# EAGLE design sr_controller_v1 (EAGLE 6.3)
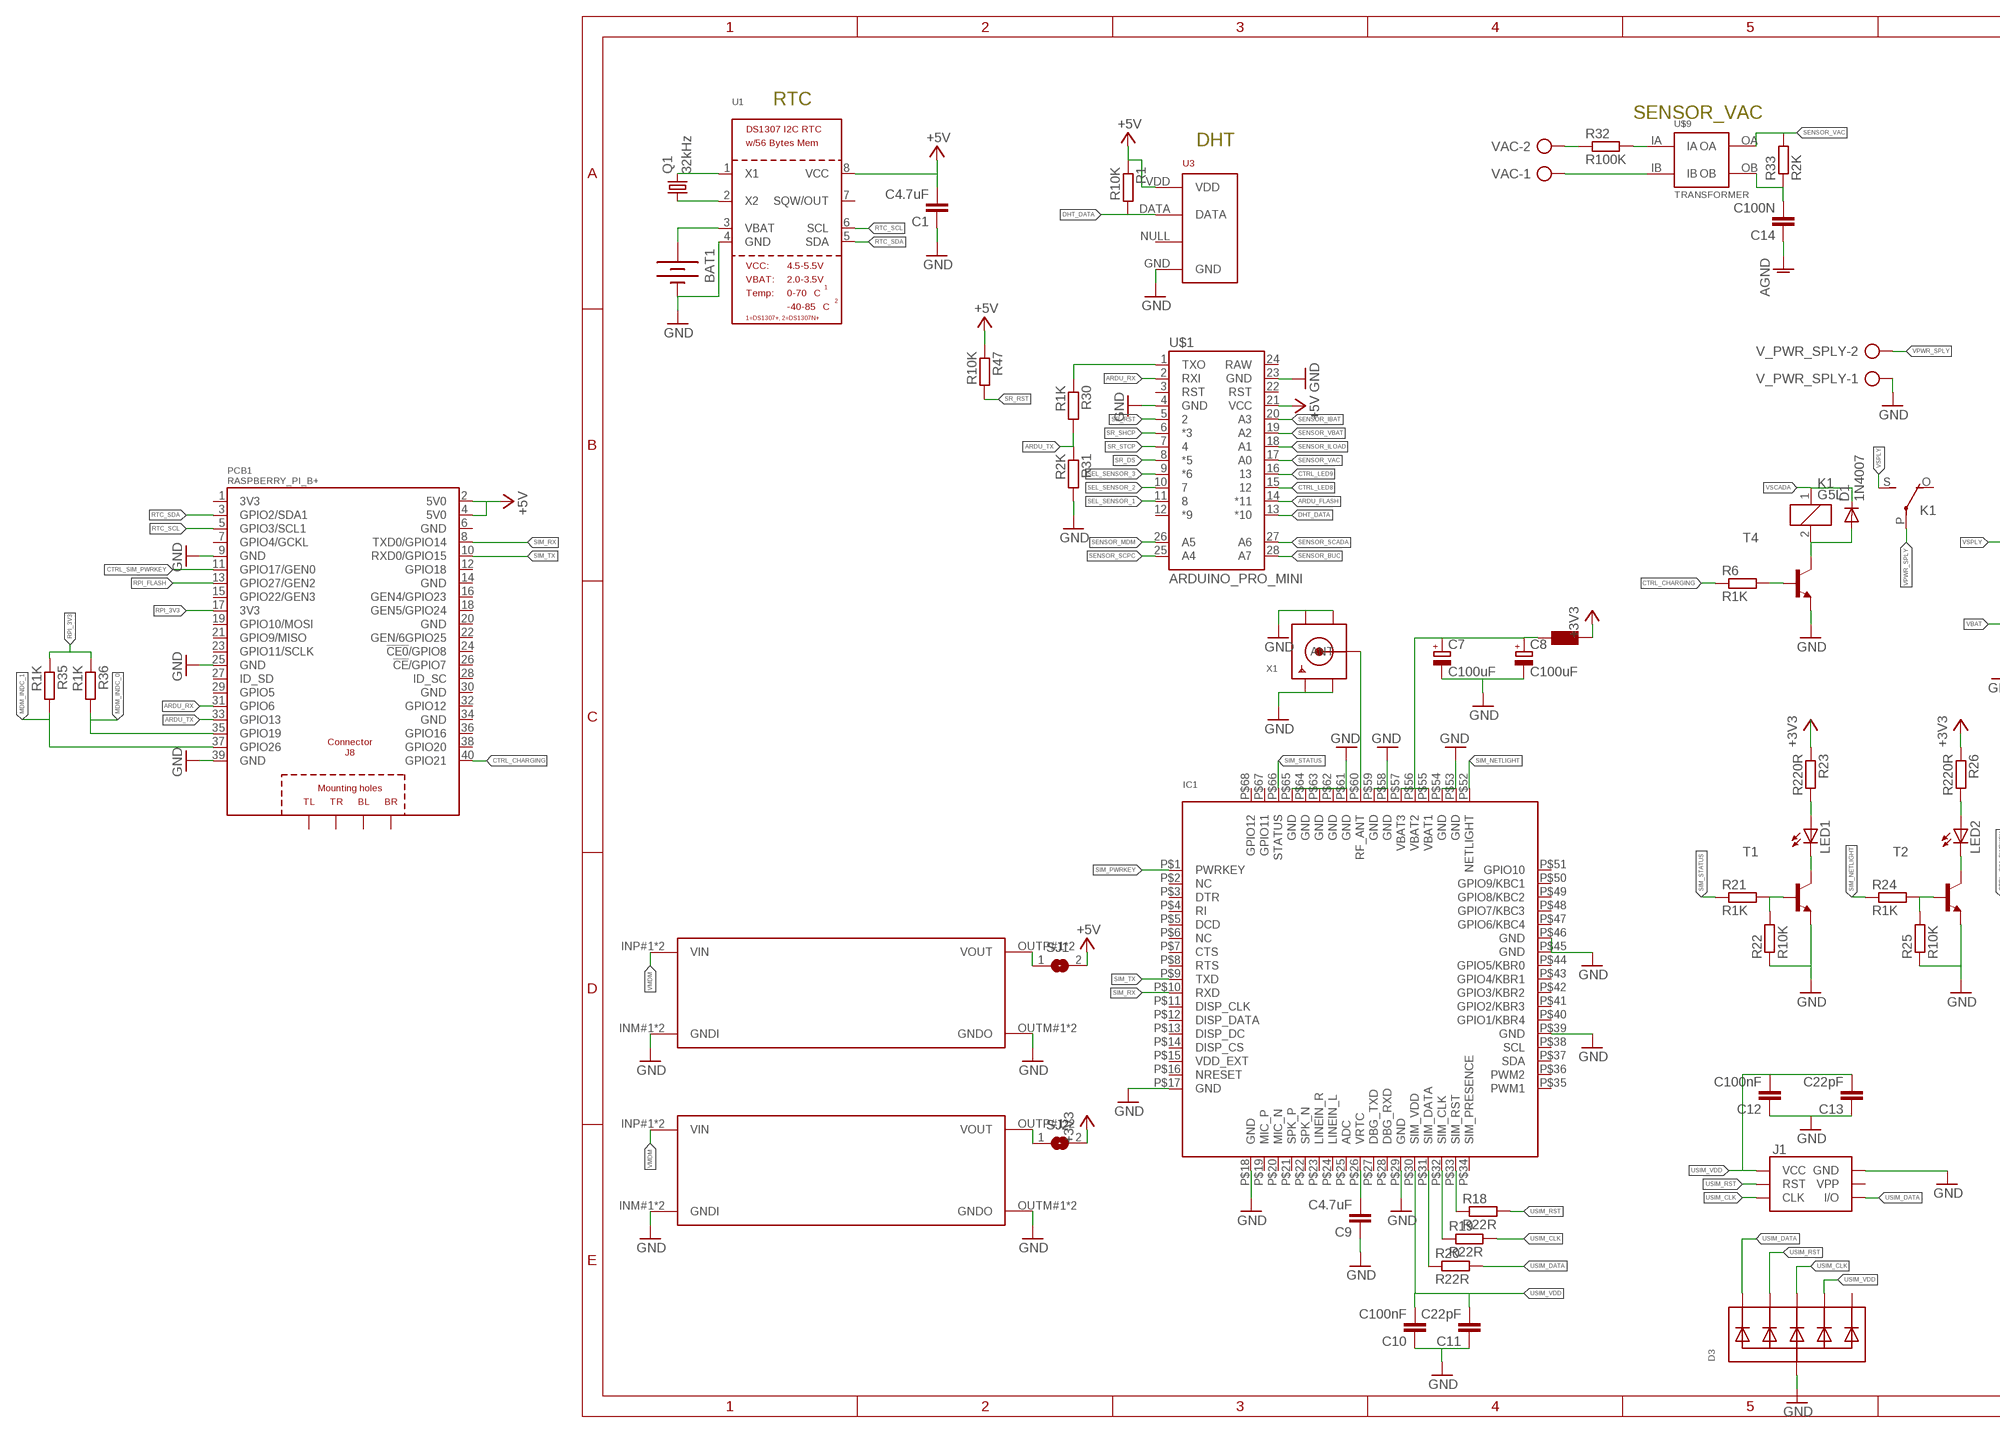
[diagram p0: schematic, sheet 1, part 1 of 2]
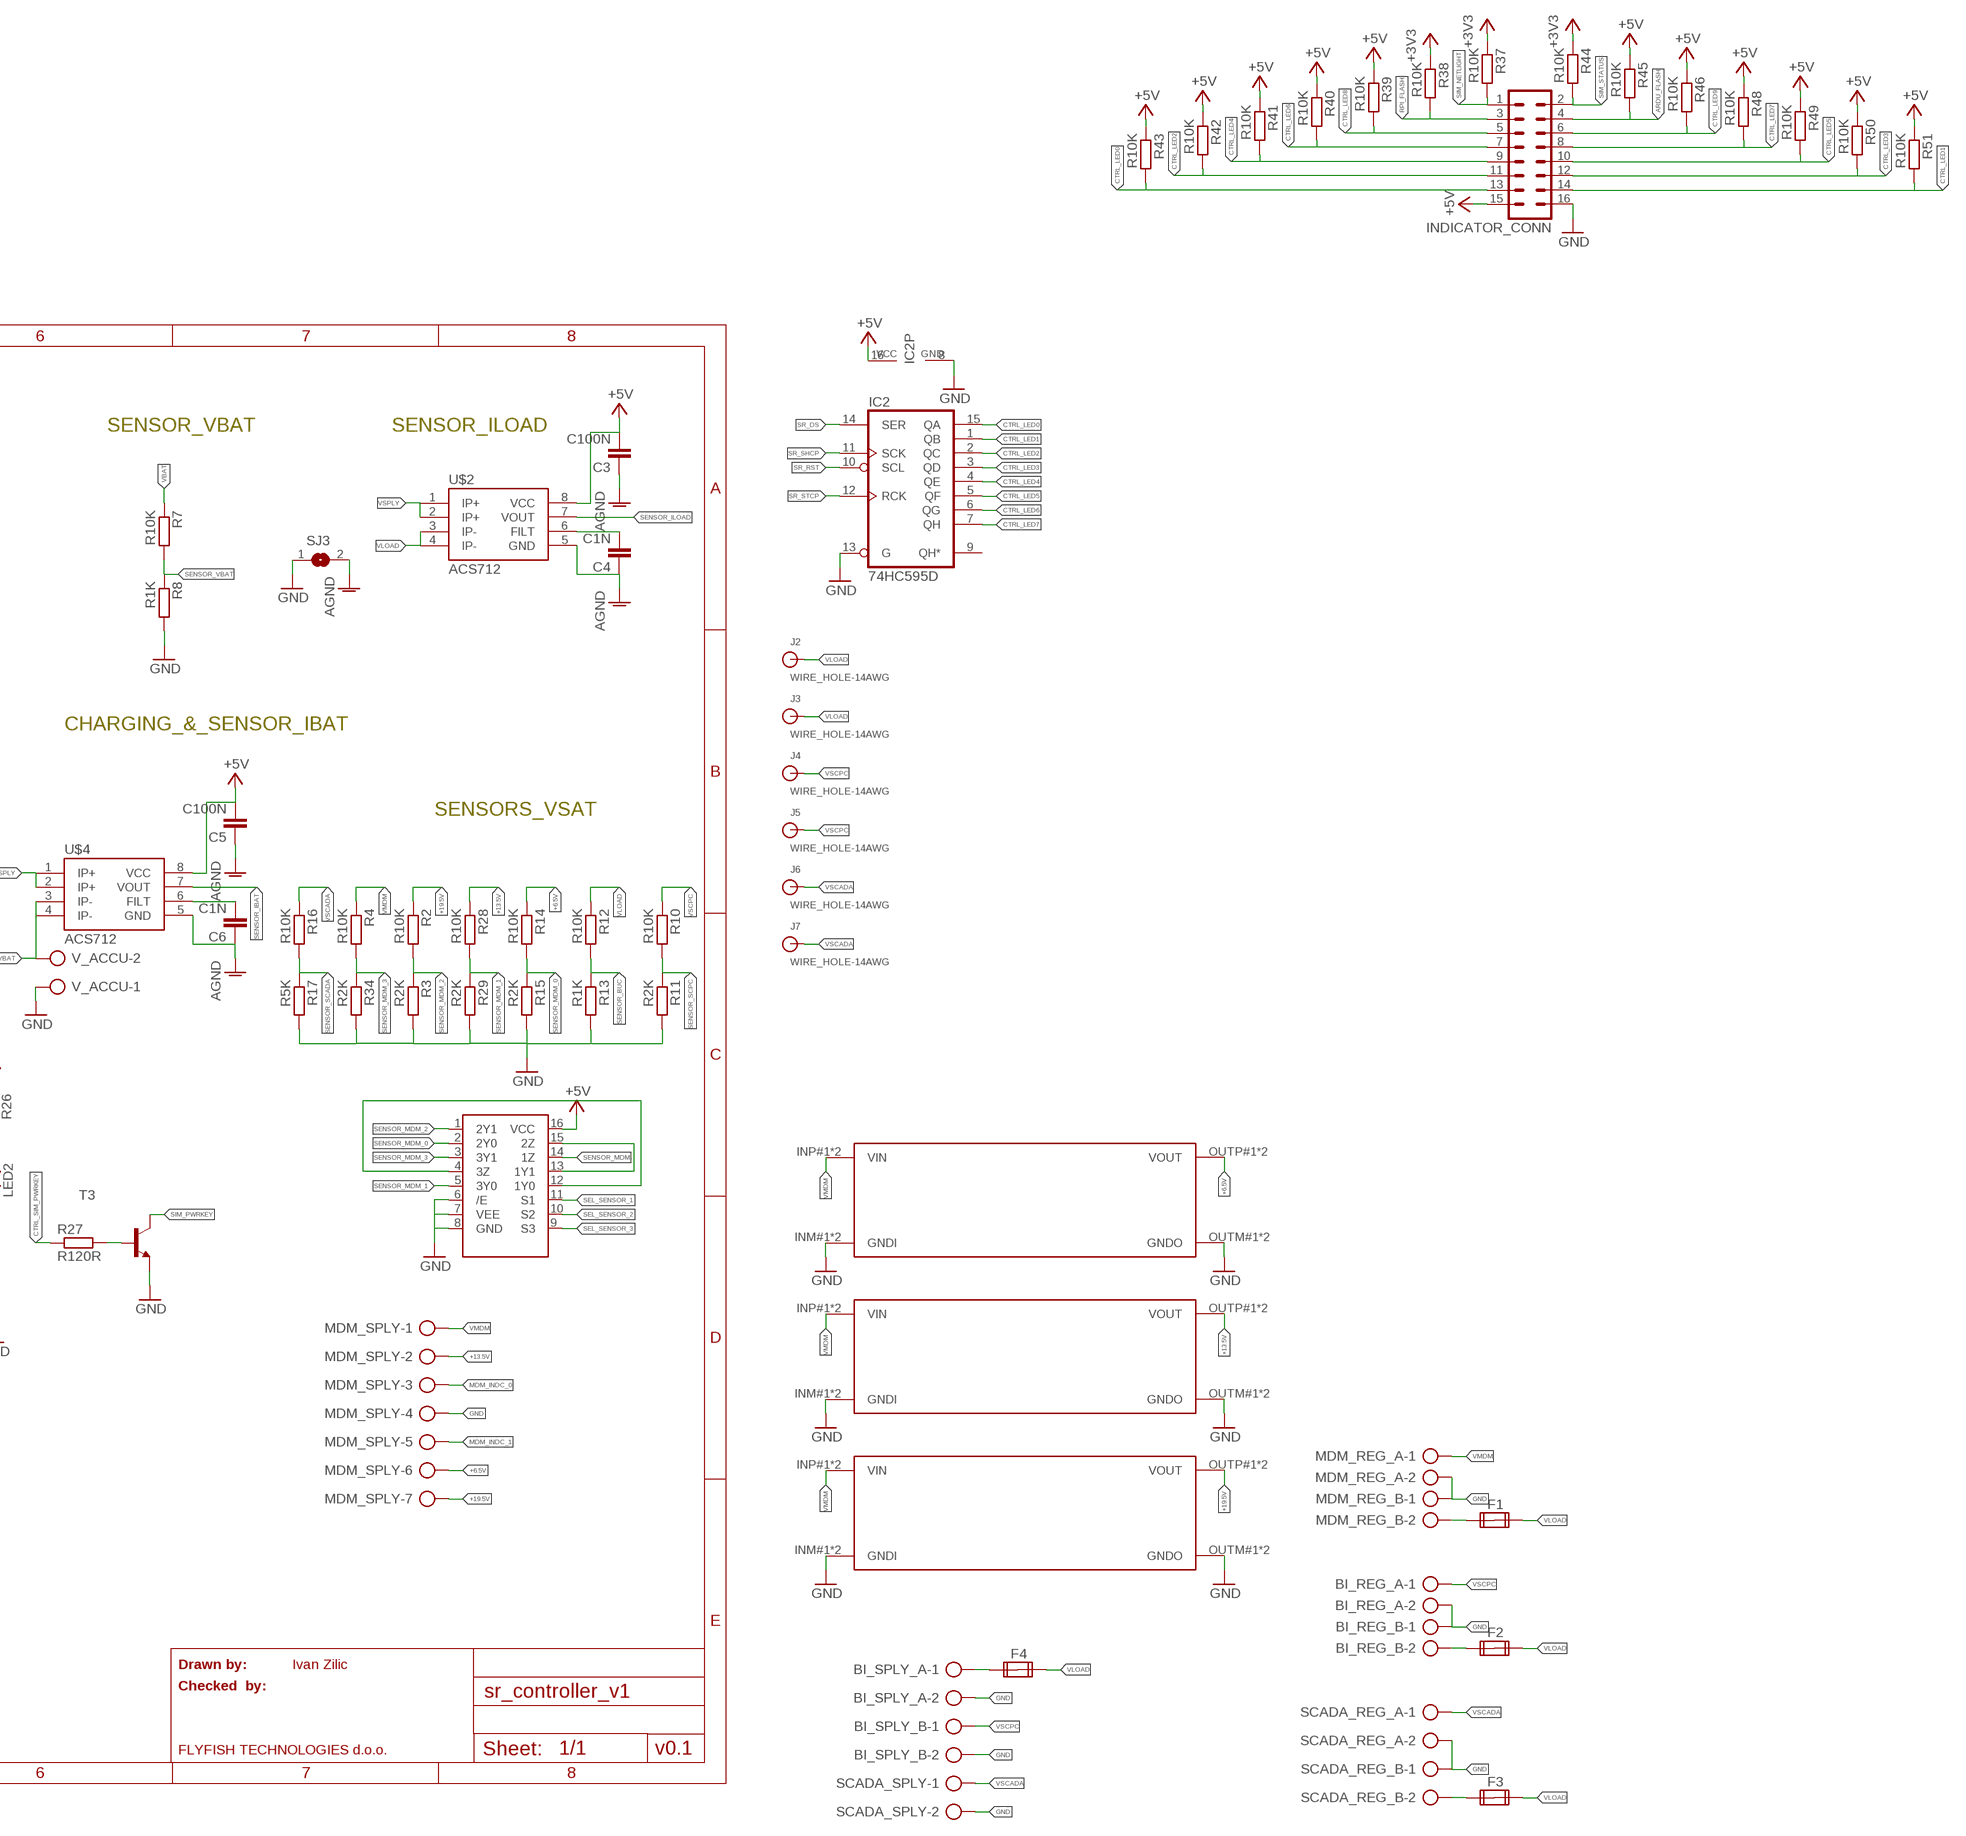
[diagram p1: schematic, sheet 1, part 2 of 2]

## Parts
BAT1  BATTERY20PTH  [BATTCOM_20MM_PTH]
BI_REG_A  AK300/2  [AK300/2]
BI_REG_B  AK300/2  [AK300/2]
BI_SPLY_A  AK300/2  [AK300/2]
BI_SPLY_B  AK300/2  [AK300/2]
C1  C4.7uF  C-EUC0805  [C0805]
C3  C100N  C-EUC0805K  [C0805K]
C4  C1N  C-EUC0805K  [C0805K]
C5  C100N  C-EUC0805K  [C0805K]
C6  C1N  C-EUC0805K  [C0805K]
C7  C100uF  CPOL-EU153CLV-0605  [153CLV-0605]
C8  C100uF  CPOL-EU153CLV-0605  [153CLV-0605]
C9  C4.7uF  C-EUC0805  [C0805]
C10  C100nF  C-EUC0805  [C0805]
C11  C22pF  C-EUC0805  [C0805]
C12  C100nF  C-EUC0805  [C0805]
C13  C22pF  C-EUC0805  [C0805]
C14  C100N  C-EUC0805K  [C0805K]
D1  1N4007  DIODE-DO214AA  [DO214AA]
D3  TVSARRAY_5LANE  [SOT363]
F1  FUSE2P  [FUSE1]
F2  FUSE2P  [FUSE1]
F3  FUSE2P  [FUSE1]
F4  FUSE2P  [FUSE1]
IC1  GSM_SIM900_LITERAL  [SIM900_SMT]
IC2  74HC595D  [SO16]
INDICATOR_CONN  MA08-2  [MA08-2]
J1  SIMHOLDERSIM  [SIMHOLDER]
J2  WIRE_HOLE-14AWG  [WIRE_HOLE-14AWG]
J3  WIRE_HOLE-14AWG  [WIRE_HOLE-14AWG]
J4  WIRE_HOLE-14AWG  [WIRE_HOLE-14AWG]
J5  WIRE_HOLE-14AWG  [WIRE_HOLE-14AWG]
J6  WIRE_HOLE-14AWG  [WIRE_HOLE-14AWG]
J7  WIRE_HOLE-14AWG  [WIRE_HOLE-14AWG]
K1  G5L  [G5LE]
LED1  LEDCHIPLED_0805  [CHIPLED_0805]
LED2  LEDCHIPLED_0805  [CHIPLED_0805]
MDM_REG_A  AK300/2  [AK300/2]
MDM_REG_B  AK300/2  [AK300/2]
MDM_SPLY  AK300/7  [AK300/7]
PCB1  RASPBERRY_PI_B+  [RASPBERRY_PI_B+]
Q1  32kHz  CRYSTALTC38H  [TC38H]
R1  R10K  R-EU_R0805  [R0805]
R2  R10K  R-EU_R0805  [R0805]
R3  R2K  R-EU_R0805  [R0805]
R4  R10K  R-EU_R0805  [R0805]
R6  R1K  R-EU_R0805  [R0805]
R7  R10K  R-EU_R0805  [R0805]
R8  R1K  R-EU_R0805  [R0805]
R10  R10K  R-EU_R0805  [R0805]
R11  R2K  R-EU_R0805  [R0805]
R12  R10K  R-EU_R0805  [R0805]
R13  R1K  R-EU_R0805  [R0805]
R14  R10K  R-EU_R0805  [R0805]
R15  R2K  R-EU_R0805  [R0805]
R16  R10K  R-EU_R0805  [R0805]
R17  R5K  R-EU_R0805  [R0805]
R18  R22R  R-EU_R0805  [R0805]
R19  R22R  R-EU_R0805  [R0805]
R20  R22R  R-EU_R0805  [R0805]
R21  R1K  R-EU_R0805  [R0805]
R22  R10K  R-EU_R0805  [R0805]
R23  R220R  R-EU_R0805  [R0805]
R24  R1K  R-EU_R0805  [R0805]
R25  R10K  R-EU_R0805  [R0805]
R26  R220R  R-EU_R0805  [R0805]
R27  R120R  R-EU_R0805  [R0805]
R28  R10K  R-EU_R0805  [R0805]
R29  R2K  R-EU_R0805  [R0805]
R30  R1K  R-EU_R0805  [R0805]
R31  R2K  R-EU_R0805  [R0805]
R32  R100K  R-EU_0309/10  [0309/10]
R33  R2K  R-EU_0309/10  [0309/10]
R34  R2K  R-EU_R0805  [R0805]
R35  R1K  R-EU_R0805  [R0805]
R36  R1K  R-EU_R0805  [R0805]
R37  R10K  R-EU_R0805  [R0805]
R38  R10K  R-EU_R0805  [R0805]
R39  R10K  R-EU_R0805  [R0805]
R40  R10K  R-EU_R0805  [R0805]
R41  R10K  R-EU_R0805  [R0805]
R42  R10K  R-EU_R0805  [R0805]
R43  R10K  R-EU_R0805  [R0805]
R44  R10K  R-EU_R0805  [R0805]
R45  R10K  R-EU_R0805  [R0805]
R46  R10K  R-EU_R0805  [R0805]
R47  R10K  R-EU_R0805  [R0805]
R48  R10K  R-EU_R0805  [R0805]
R49  R10K  R-EU_R0805  [R0805]
R50  R10K  R-EU_R0805  [R0805]
R51  R10K  R-EU_R0805  [R0805]
SCADA_REG_A  AK300/2  [AK300/2]
SCADA_REG_B  AK300/2  [AK300/2]
SCADA_SPLY  AK300/2  [AK300/2]
SJ1  SOLDERJUMPER  [SOLDERJUMPER_ARROW_NOPASTE]
SJ2  SOLDERJUMPER  [SOLDERJUMPER_ARROW_NOPASTE]
SJ3  SOLDERJUMPERCLOSED  [SOLDERJUMPER_CLOSEDWIRE]
T1  MMBT2222ALT1-NPN-SOT23-BEC  [SOT23-BEC]
T2  MMBT2222ALT1-NPN-SOT23-BEC  [SOT23-BEC]
T3  MMBT2222ALT1-NPN-SOT23-BEC  [SOT23-BEC]
T4  MMBT2222ALT1-NPN-SOT23-BEC  [SOT23-BEC]
U1  RTC_DS1307  [SOIC8_150MIL]
U3  RHT03_DHT-22_AM2302  [RHT03_DHT-22]
U$1  ARDUINO_PRO_MINI  [ARDUINO_PRO_MINI]
U$2  ACS712  [SO08]
U$4  ACS712  [SO08]
U$5  FB0603  L0603  [L0603]
U$6  DCDCMODULE_SMALL  [DCDCMODULE-SMALL]
U$7  DCDCMODULE_SMALL  [DCDCMODULE-SMALL]
U$8  74HC4053D  [SO16]
U$9  TRANSFORMER  [TV16]
U$10  DCDCMODULE_SMALL  [DCDCMODULE-SMALL]
U$11  DCDCMODULE_SMALL  [DCDCMODULE-SMALL]
U$13  DCDCMODULE_SMALL  [DCDCMODULE-SMALL]
V_ACCU  AK300/2  [AK300/2]
V_PWR_SPLY  AK300/2  [AK300/2]
VAC  AK300/2  [AK300/2]
X1  SMACONNECTOR  [SMA90_DIP]

## Nets
+3V3: R23.1 R26.1 R37.1 R38.1 R44.1 SJ2.2 U$5.2
+5V: C1.2 C3.2 C5.2 IC2.16(VCC) INDICATOR_CONN.15 PCB1.2(5V0) PCB1.4(5V0) R1.1 R39.1 R40.1 R41.1 R42.1 R43.1 R45.1 R46.1 R47.1 R48.1 R49.1 R50.1 R51.1 SJ1.2 U1.8(VCC) U3.VDD U$1.21(VCC) U$2.8(VCC) U$4.8(VCC) U$8.16(VCC)
+6.5V: MDM_SPLY.6 R14.1 U$13.OUTP#1(VOUT) U$13.OUTP#2(VOUT)
+13.5V: MDM_SPLY.2 R28.1 U$10.OUTP#1(VOUT) U$10.OUTP#2(VOUT)
+19.5V: MDM_SPLY.7 R2.1 U$11.OUTP#1(VOUT) U$11.OUTP#2(VOUT)
AGND: C3.1 C4.1 C5.1 C6.1 C14.1 SJ3.2 U$2.5(GND) U$4.5(GND)
ARDU_FLASH: INDICATOR_CONN.4 R45.2 U$1.14(*11)
ARDU_RX: PCB1.31(GPIO6) U$1.2(RXI)
ARDU_TX: PCB1.33(GPIO13) R30.2 R31.1
CTRL_CHARGING: PCB1.40(GPIO21) R6.1
CTRL_LED0: IC2.15(QA) INDICATOR_CONN.13 R43.2
CTRL_LED1: IC2.1(QB) INDICATOR_CONN.14 R51.2
CTRL_LED2: IC2.2(QC) INDICATOR_CONN.11 R42.2
CTRL_LED3: IC2.3(QD) INDICATOR_CONN.12 R50.2
CTRL_LED4: IC2.4(QE) INDICATOR_CONN.9 R41.2
CTRL_LED5: IC2.5(QF) INDICATOR_CONN.10 R49.2
CTRL_LED6: IC2.6(QG) INDICATOR_CONN.7 R40.2
CTRL_LED7: IC2.7(QH) INDICATOR_CONN.8 R48.2
CTRL_LED8: INDICATOR_CONN.5 R39.2 U$1.15
CTRL_LED9: INDICATOR_CONN.6 R46.2 U$1.16
CTRL_SIM_PWRKEY: PCB1.11(GPIO17/GEN0) R27.1
DHT_DATA: R1.2 U3.DATA U$1.13(*10)
GND: BAT1.2(-) BI_REG_A.2 BI_REG_B.1 BI_SPLY_A.2 BI_SPLY_B.2 C1.1 C7.- C8.- C9.1 C10.1 C11.1 C12.1 C13.1 D3.2(A) IC1.P$17(GND) IC1.P$18(GND) IC1.P$29(GND) IC1.P$39(GND) IC1.P$45(GND) IC1.P$46(GND) IC1.P$53(GND) IC1.P$54(GND) IC1.P$58(GND) IC1.P$59(GND) IC1.P$61(GND) IC1.P$62(GND) IC1.P$63(GND) IC1.P$64(GND) IC1.P$65(GND) IC2.8(GND) IC2.13(G) INDICATOR_CONN.16 J1.C5(GND) MDM_REG_A.2 MDM_REG_B.1 MDM_SPLY.4 PCB1.9(GND) PCB1.25(GND) PCB1.39(GND) R3.2 R8.2 R11.2 R13.2 R15.2 R17.2 R22.1 R25.1 R29.2 R31.2 R34.2 SCADA_REG_A.2 SCADA_REG_B.1 SCADA_SPLY.2 SJ3.1 T1.E T2.E T3.E T4.E U1.4(GND) U3.GND U$1.4(GND) U$1.23(GND) U$6.INM#1(GNDI) U$6.INM#2(GNDI) U$6.OUTM#1(GNDO) U$6.OUTM#2(GNDO) U$7.INM#1(GNDI) U$7.INM#2(GNDI) U$7.OUTM#1(GNDO) U$7.OUTM#2(GNDO) U$8.6(/E) U$8.7(VEE) U$8.8(GND) U$10.INM#1(GNDI) U$10.INM#2(GNDI) U$10.OUTM#1(GNDO) U$10.OUTM#2(GNDO) U$11.INM#1(GNDI) U$11.INM#2(GNDI) U$11.OUTM#1(GNDO) U$11.OUTM#2(GNDO) U$13.INM#1(GNDI) U$13.INM#2(GNDI) U$13.OUTM#1(GNDO) U$13.OUTM#2(GNDO) V_ACCU.1 V_PWR_SPLY.1 X1.GND1 X1.GND2 X1.GND3 X1.GND4
MDM_INDC_0: MDM_SPLY.3 PCB1.35(GPIO19) R36.2
MDM_INDC_1: MDM_SPLY.5 PCB1.37(GPIO26) R35.2
N$1: R32.1 VAC.2
N$2: U$9.IB VAC.1
N$3: Q1.2 U1.1(X1)
N$4: Q1.1 U1.2(X2)
N$5: BAT1.1(+) U1.3(VBAT)
N$6: U$8.13(1Y1) U$8.15(2Z)
N$7: U$8.4(3Z) U$8.12(1Y0)
N$8: SJ1.1 U$6.OUTP#1(VOUT) U$6.OUTP#2(VOUT)
N$9: SJ2.1 U$7.OUTP#1(VOUT) U$7.OUTP#2(VOUT)
N$10: C4.2 U$2.6(FILT)
N$13: R6.2 T4.B
N$16: C6.2 U$4.6(FILT)
N$17: F1.1A MDM_REG_B.2
N$18: BI_REG_B.2 F2.1A
N$19: F3.1A SCADA_REG_B.2
N$20: BI_SPLY_A.1 F4.1A
N$21: IC1.P$60(RF_ANT) X1.ANTENNA(ANT)
N$22: C7.+ C8.+ IC1.P$55(VBAT1) IC1.P$56(VBAT2) IC1.P$57(VBAT3) U$5.1
N$23: C9.2 IC1.P$26(VRTC)
N$24: IC1.P$33(SIM_RST) R18.1
N$25: IC1.P$32(SIM_CLK) R19.1
N$26: IC1.P$31(SIM_DATA) R20.1
N$27: LED1.C T1.C
N$28: LED1.A R23.2
N$29: LED2.C T2.C
N$30: R21.2 R22.2 T1.B
N$31: LED2.A R26.2
N$32: R24.2 R25.2 T2.B
N$33: R27.2 T3.B
N$34: D1.A K1.2 T4.C
N$35: R30.1 U$1.1(TXO)
N$36: R32.2 U$9.IA
N$38: C14.2 R33.1 U$9.OB
RPI_3V3: PCB1.17(3V3) R35.1 R36.1
RPI_FLASH: INDICATOR_CONN.3 PCB1.13(GPIO27/GEN2) R38.2
RTC_SCL: PCB1.5(GPIO3/SCL1) U1.6(SCL)
RTC_SDA: PCB1.3(GPIO2/SDA1) U1.5(SDA)
SEL_SENSOR_1: U$1.11 U$8.11(S1)
SEL_SENSOR_2: U$1.10 U$8.10(S2)
SEL_SENSOR_3: U$1.9(*6) U$8.9(S3)
SENSOR_BUC: R12.2 R13.1 U$1.28(A7)
SENSOR_IBAT: U$1.20(A3) U$4.7(VOUT)
SENSOR_ILOAD: U$1.18(A1) U$2.7(VOUT)
SENSOR_MDM: U$1.26(A5) U$8.14(1Z)
SENSOR_MDM_0: R14.2 R15.1 U$8.2(2Y0)
SENSOR_MDM_1: R28.2 R29.1 U$8.5(3Y0)
SENSOR_MDM_2: R2.2 R3.1 U$8.1(2Y1)
SENSOR_MDM_3: R4.2 R34.1 U$8.3(3Y1)
SENSOR_SCADA: R16.2 R17.1 U$1.27(A6)
SENSOR_SCPC: R10.2 R11.1 U$1.25(A4)
SENSOR_VAC: R33.2 U$1.17(A0) U$9.OA
SENSOR_VBAT: R7.2 R8.1 U$1.19(A2)
SIM_NETLIGHT: IC1.P$52(NETLIGHT) INDICATOR_CONN.1 R24.1 R37.2
SIM_PWRKEY: IC1.P$1(PWRKEY) T3.C
SIM_RX: IC1.P$10(RXD) PCB1.8(TXD0/GPIO14)
SIM_STATUS: IC1.P$66(STATUS) INDICATOR_CONN.2 R21.1 R44.2
SIM_TX: IC1.P$9(TXD) PCB1.10(RXD0/GPIO15)
SR_DS: IC2.14(SER) U$1.8(*5)
SR_RST: IC2.10(SCL) R47.2 U$1.5
SR_SHCP: IC2.11(SCK) U$1.6(*3)
SR_STCP: IC2.12(RCK) U$1.7
USIM_CLK: D3.4(C3) J1.C3(CLK) R19.2
USIM_DATA: D3.1(C1) J1.C7(I/O) R20.2
USIM_RST: D3.3(C2) J1.C2(RST) R18.2
USIM_VDD: C10.2 C11.2 C12.2 C13.2 D3.5(C4) IC1.P$30(SIM_VDD) J1.C1(VCC)
VBAT: R7.1 U$4.3(IP-) U$4.4(IP-) V_ACCU.2
VLOAD: F1.2A F2.2A F3.2A F4.2A J2.P$1 J3.P$1 R12.1 U$2.3(IP-) U$2.4(IP-)
VMDM: MDM_REG_A.1 MDM_SPLY.1 R4.1 U$6.INP#1(VIN) U$6.INP#2(VIN) U$7.INP#1(VIN) U$7.INP#2(VIN) U$10.INP#1(VIN) U$10.INP#2(VIN) U$11.INP#1(VIN) U$11.INP#2(VIN) U$13.INP#1(VIN) U$13.INP#2(VIN)
VPWR_SPLY: K1.P(2:P) V_PWR_SPLY.2
VSCADA: D1.C J6.P$1 J7.P$1 K1.1 R16.1 SCADA_REG_A.1 SCADA_SPLY.1
VSCPC: BI_REG_A.1 BI_SPLY_B.1 J4.P$1 J5.P$1 R10.1
VSPLY: K1.S(2:S) U$2.1(IP+) U$2.2(IP+) U$4.1(IP+) U$4.2(IP+)
Unconnected: D3.6(C5) F1.1B F1.2B F2.1B F2.2B F3.1B F3.2B F4.1B F4.2B IC1.P$2(NC) IC1.P$3(DTR) IC1.P$4(RI) IC1.P$5(DCD) IC1.P$6(NC) IC1.P$7(CTS) IC1.P$8(RTS) IC1.P$11(DISP_CLK) IC1.P$12(DISP_DATA) IC1.P$13(DISP_DC) IC1.P$14(DISP_CS) IC1.P$15(VDD_EXT) IC1.P$16(NRESET) IC1.P$19(MIC_P) IC1.P$20(MIC_N) IC1.P$21(SPK_P) IC1.P$22(SPK_N) IC1.P$23(LINEIN_R) IC1.P$24(LINEIN_L) IC1.P$25(ADC) IC1.P$27(DBG_TXD) IC1.P$28(DBG_RXD) IC1.P$34(SIM_PRESENCE) IC1.P$35(PWM1) IC1.P$36(PWM2) IC1.P$37(SDA) IC1.P$38(SCL) IC1.P$40(GPIO1/KBR4) IC1.P$41(GPIO2/KBR3) IC1.P$42(GPIO3/KBR2) IC1.P$43(GPIO4/KBR1) IC1.P$44(GPIO5/KBR0) IC1.P$47(GPIO6/KBC4) IC1.P$48(GPIO7/KBC3) IC1.P$49(GPIO8/KBC2) IC1.P$50(GPIO9/KBC1) IC1.P$51(GPIO10) IC2.9(QH*) J1.C6(VPP) K1.O(2:O) PCB1.1(3V3) PCB1.6(GND) PCB1.7(GPIO4/GCKL) PCB1.12(GPIO18) PCB1.14(GND) PCB1.15(GPIO22/GEN3) PCB1.16(GEN4/GPIO23) PCB1.18(GEN5/GPIO24) PCB1.19(GPIO10/MOSI) PCB1.20(GND) PCB1.21(GPIO9/MISO) PCB1.22(GEN/6GPIO25) PCB1.23(GPIO11/SCLK) PCB1.24(!CE0!/GPIO8) PCB1.26(!CE!/GPIO7) PCB1.27(ID_SD) PCB1.28(ID_SC) PCB1.29(GPIO5) PCB1.30(GND) PCB1.32(GPIO12) PCB1.34(GND) PCB1.36(GPIO16) PCB1.38(GPIO20) PCB1.PE_BL(BL) PCB1.PE_BR(BR) PCB1.PE_TL(TL) PCB1.PE_TR(TR) U1.7(SQW/OUT) U3.NULL U$1.3(RST) U$1.12(*9) U$1.22(RST) U$1.24(RAW)

## Notes on the sheet
- RTC
- SENSOR_VAC | SENSOR_VBAT | SENSOR_ILOAD
- DHT
- CHARGING_&_SENSOR_IBAT
- SENSORS_VSAT
- Drawn by: | Ivan Zilic
- Checked  by:
- FLYFISH TECHNOLOGIES d.o.o. | v0.1

## Power pins joined to a net without a drawn wire
GPIO11: IC1.P$67(GPIO11)
GPIO12: IC1.P$68(GPIO12)

## Library data of the parts
BAT1 = SparkFun-Electromechanical:BATTERY: Battery Holders Various common sizes : AA, AAA, 20mm coin cell and 12mm coin cell. 20MM_4LEGS, BATT-10373
BI_REG_A BI_REG_B BI_SPLY_A BI_SPLY_B MDM_REG_A MDM_REG_B SCADA_REG_A SCADA_REG_B SCADA_SPLY V_ACCU V_PWR_SPLY VAC = con-ptr500:AK300/2: CONNECTOR; OC_FARNELL: unknown; OC_NEWARK: unknown
C1 C3-C6 C9-C14 = resistor:C-EU: CAPACITOR, European symbol
C7 C8 = resistor:CPOL-EU: POLARIZED CAPACITOR, European symbol
D1 = diode:DIODE-: DIODE
D3 = microbuilder:TVSARRAY_5LANE: Voltage Transient Suppressor Array SOT363 SMF05C - 100W 5V: Digikey - SMF05CT1GOSCT-ND
F1-F4 = special:FUSE2P: FUSE 5 x 20 mm
IC1 = microbuilder:GSM_SIM900_LITERAL: SIM900 Quad-Band GSM/GPRS Module Power Supply: 3.2-4.8V Temperature Range: -30�C-+80�C Bands: GSM 850, EGSM 900, DCS 1800, PCS 1900
IC2 = 74xx-eu:74*595: 8-bit SHIFT REGISTER, output latch
INDICATOR_CONN = con-lstb:MA08-2: PIN HEADER; OC_FARNELL: unknown; OC_NEWARK: unknown
J1 = SparkFun-Connectors:SIMHOLDER: SIM Socket Socket for SIM cellular cards. Schematic element and footprint production proven. Spark Fun Electronics SKU : PRT-00548; PROD_ID: CONN-08536
J2-J7 = powercube:WIRE_HOLE-14AWG: Solder point for 14AWG wire
K1 = relay:G5L: RELAY 1 x switch, 10 A/120 V AC, 8 A/30 V ADC, Omron; OC_FARNELL: unknown; OC_NEWARK: unknown
LED1 LED2 = adafruit:LED: LED OSRAM: - CHIPLED LG R971, LG N971, LY N971, LG Q971, LY Q971, LO R971, LY R971 LH N974, LH R974 LS Q976, LO Q976, LY Q976 LO Q996 - Hyper CHIPLED LW Q18S LB Q993, LB Q99A, LB R99A - SideLED LS A670, LO A670, LY A670, LG A670, LP A670 LB A673, LV A673, LT A673, LW A673 LH A674 LY A675 LS A676, LA A676, LO A676, LY A676, LW A676 LS A679, LY A679, LG A679 - Hyper Micro SIDELED® LS Y876, LA Y876, LO Y876, LY Y876 LT Y87S - SmartLED LW L88C, LW L88S LB L89C, LB L89S, LG L890 LS L89K, LO L89K, LY L89K LS L896, LA L896, LO L896, LY L896 - TOPLED LS T670, LO T670, LY T670, LG T670, LP T670 LSG T670, LSP T670, LSY T670, LOP T670, LYG T670 LG T671, LOG T671, LSG T671 LB T673, LV T673, LT T673, LW T673 LH T674 LS T676, LA T676, LO T676, LY T676, LB T676, LH T676, LSB T676, LW T676 LB T67C, LV T67C, LT T67C, LS T67K, LO T67K, LY T67K, LW E67C LS E67B, LA E67B, LO E67B, LY E67B, LB E67C, LV E67C, LT E67C LW T67C LS T679, LY T679, LG T679 LS T770, LO T770, LY T770, LG T770, LP T770 LB T773, LV T773, LT T773, LW T773 LH T774 LS E675, LA E675, LY E675, LS T675 LS T776, LA T776, LO T776, LY T776, LB T776 LHGB T686 LT T68C, LB T68C - Hyper Mini TOPLED® LB M676 - Mini TOPLED Santana® LG M470 LS M47K, LO M47K, LY M47K Source: http://www.osram.convergy.de/
MDM_SPLY = con-ptr500:AK300/7: CONNECTOR; OC_FARNELL: unknown; OC_NEWARK: unknown
PCB1 = RASPBERRY_PI_Bplus:RASPBERRY_PI_B+: Raspberry Pi B+ Based on issue: Thursday, July 10, 2014 - Rev 1.2 LBR by Tim R. 07-2014
Q1 = crystal:CRYSTAL: CRYSTAL; OC_FARNELL: unknown; OC_NEWARK: unknown
R1-R4 R6-R8 R10-R51 = resistor:R-EU_: RESISTOR, European symbol
SJ1 SJ2 = microbuilder:SOLDERJUMPER: SMD Solder JUMPER Solder the two pads together to create a connection, or remove the solder to break it. REFLOW - Use this footprint for solder paste and reflow ovens. WAVE - Use this footprint for hand-soldering (larger pads). CLOSED - Has a trace between the two pads to ensure it is closed by default. The trace needs to be cut to disable the jumper, and can be closed again by creating a solder bridge between the two pads.; BOM: EXCLUDE
SJ3 = microbuilder:SOLDERJUMPER: SMD Solder JUMPER Solder the two pads together to create a connection, or remove the solder to break it. REFLOW - Use this footprint for solder paste and reflow ovens. WAVE - Use this footprint for hand-soldering (larger pads). CLOSED - Has a trace between the two pads to ensure it is closed by default. The trace needs to be cut to disable the jumper, and can be closed again by creating a solder bridge between the two pads.
T1-T4 = transistor:*-NPN-: NPN Transistror BF959 corrected 2008.03.06
U1 = microbuilder:RTC_DS1307: DS1307 I2C RTC with 56-Bytes RAM
U3 = RHT03_DHT-22_AM2302:RHT03_DHT-22_AM2302: RHT03 / DHT-22 / AM2302 Packages and symbol for the RHT03 / DHT-22 relative humidity and temperature sensor. Note: The AM2302 is a wired version of the DHT-22 which typically requires less clearance and is thus provided as a separate package.; PROD_ID: SEN-10167
U$1 = tigorcustom:ARDUINO_PRO_MINI
U$2 U$4 = SparkFun-AnalogIC:ACS712: Hall-effect-based isolated linear current sensor
U$5 = tigorcustom:L0603
U$6 U$7 U$10 U$11 U$13 = bontor:DCDCMODULE_SMALL
U$8 = tigorcustom:74HC4053D
U$9 = bontor:TRANSFORMER
X1 = microbuilder:SMACONNECTOR: SMA Connector 90� DIP SMA Connector, 50 Ohm (4UConnector: 07259)

## Board
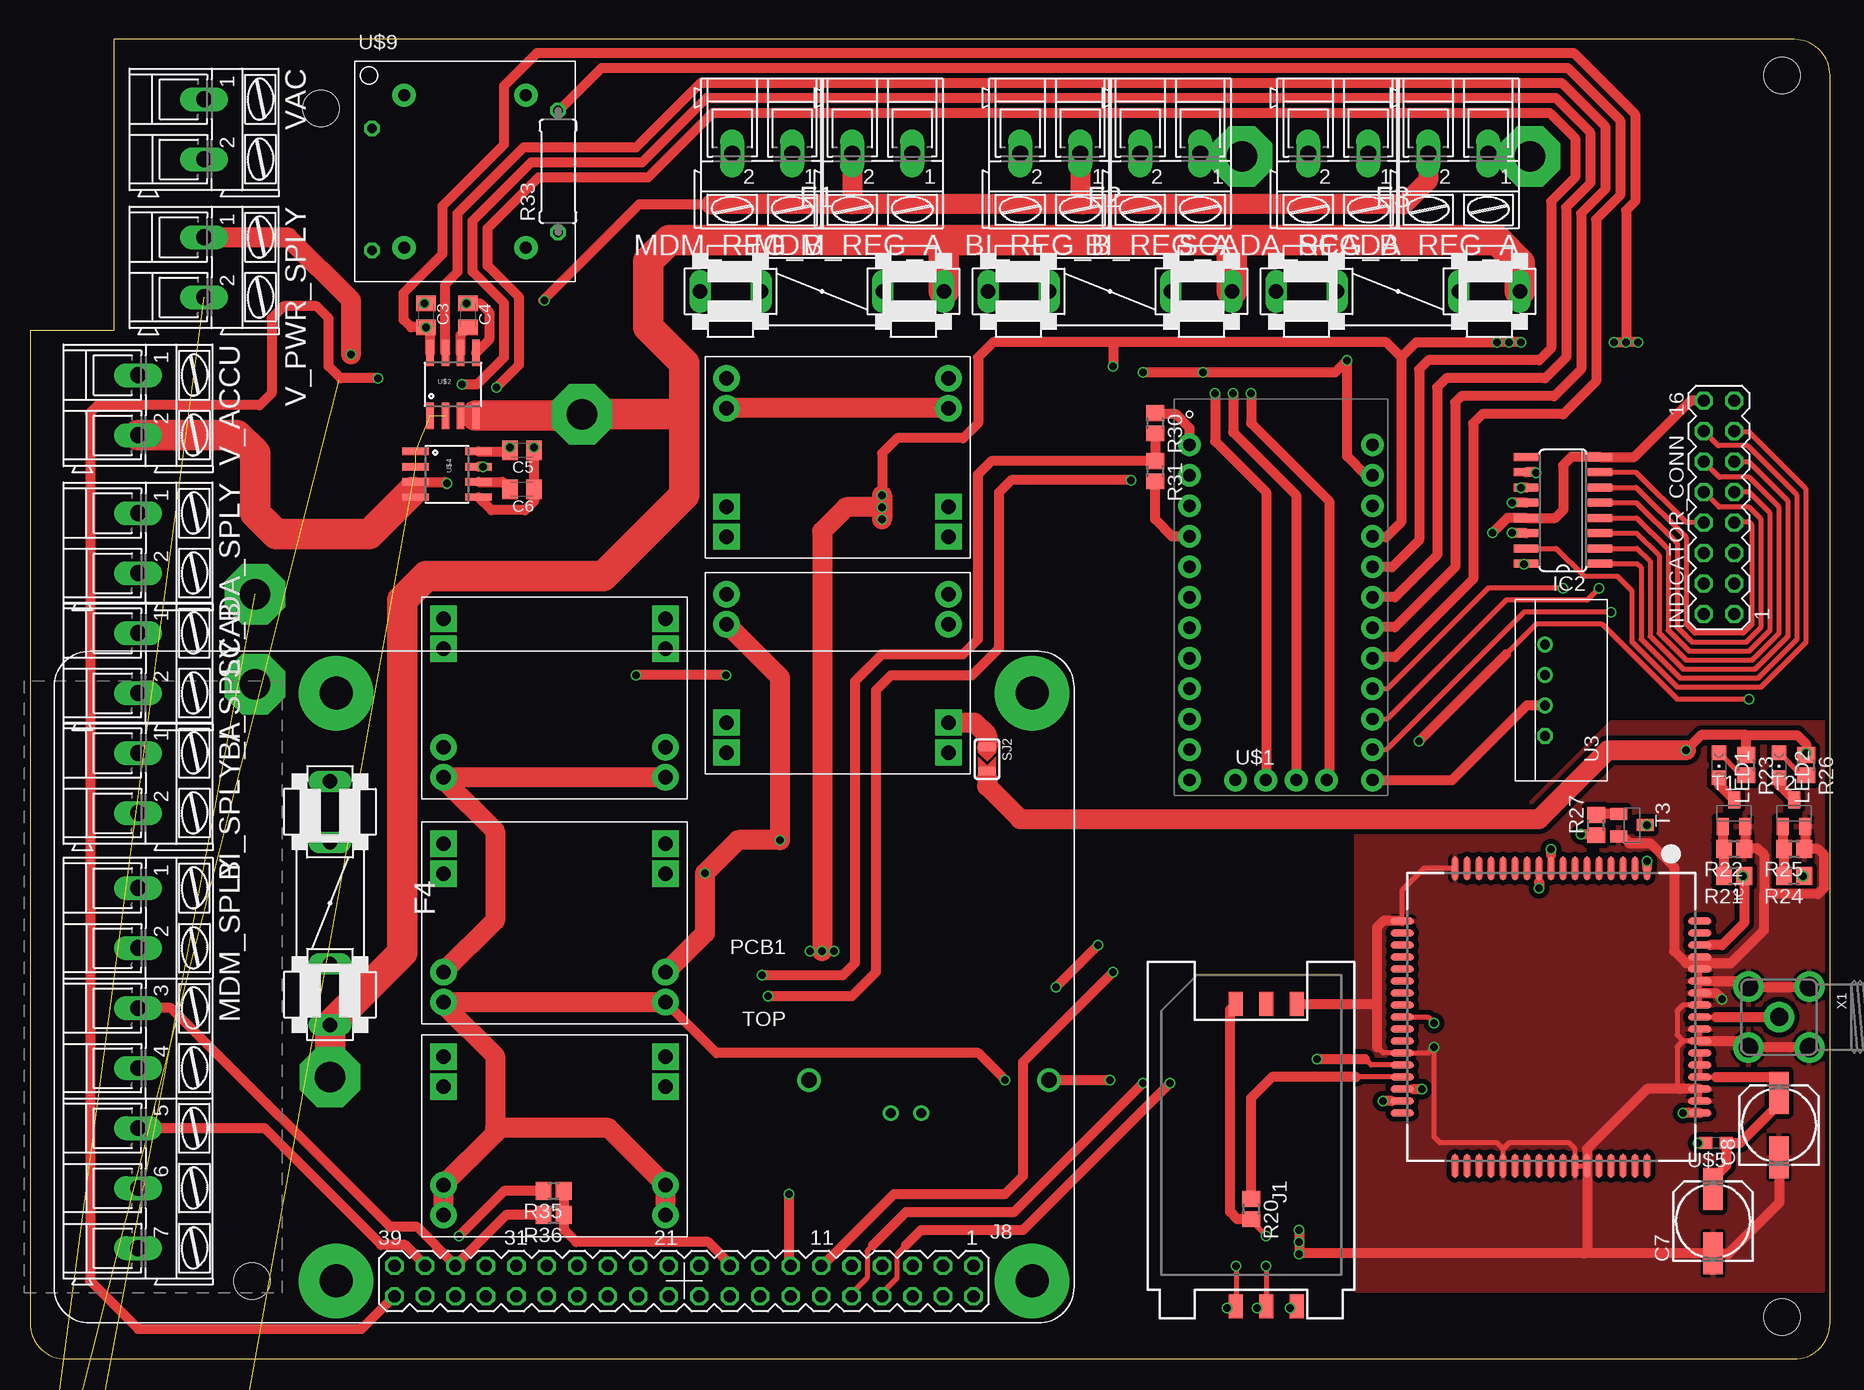
[diagram p2: board, top side]
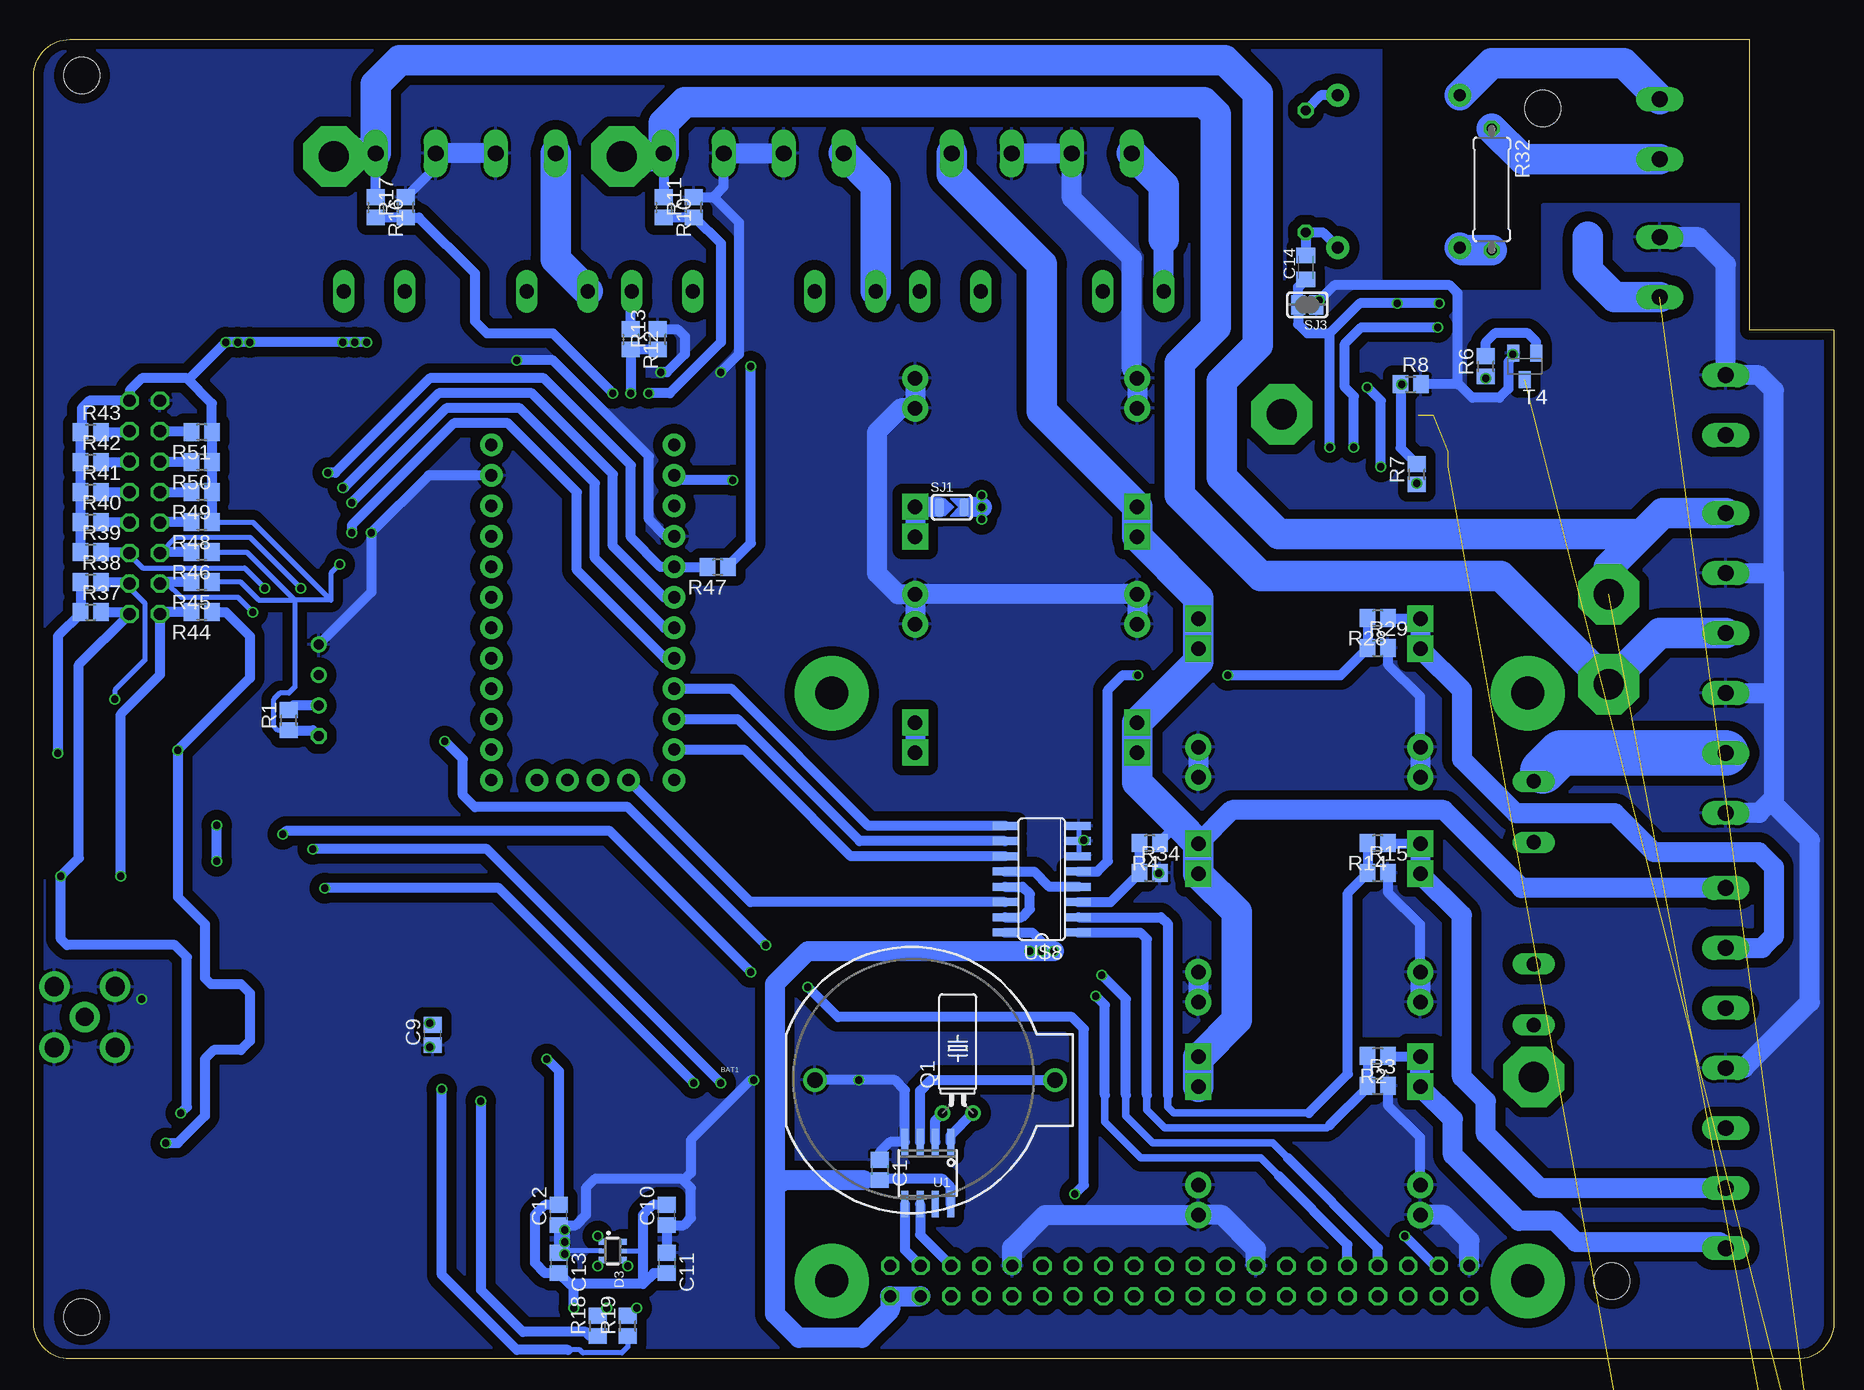
[diagram p3: board, bottom side, seen from below]

Size 150 x 110 mm. Coordinates in mm from the lower left corner, seen from the top.
Outline: 0,3 arc90 3,0 147,0 arc90 150,3 150,107 arc90 147,110 7,110 7,85.75 0,85.75 0,3
Copper layers (1*16): Top 0.035mm / dielectric 1.5mm / Bottom 0.035mm
Design rules "ITEADstudio_DRC": minimum track width 6mil, minimum drill 12mil, track to track 6mil, track to pad 6mil, pad to pad 6mil, via to via 6mil, smd to smd 0mil, copper to edge 10mil, drill to drill 10mil, minimum pad ring 10mil, minimum via ring 6mil, stop-mask expansion 2mil, vias tented up to drill 100mil, thermal gap 10mil
Holes 3 mm at 18.5,6.5 24.25,104.25 146,107 146,3.5

### Footprints (pad centres in the part's own frame; a part is rotated, then mirrored left to right if it is on the bottom)
BATTCOM_20MM_PTH = drill 1.3: 1 11.85,0; 2 -8.15,0
AK300/2 = drill 1.321 long: 1 -2.515,0; 2 2.489,0
C0805 = smd 1.3 x 1.5: 1 -0.85,0; 2 0.85,0
C0805K = smd 1.3 x 1.6: 1 -1,0; 2 1,0
153CLV-0605 = smd 3.5 x 1.6: + 2.7,0; - -2.7,0
DO214AA = smd 1.8 x 2.2: A 2.55,0; C -2.55,0
SOT363 = smd 0.5 x 0.5: 1 -0.75,-0.9; 3 0.75,-0.9; 4 0.75,0.9; 6 -0.75,0.9 | smd 0.4 x 0.5: 2 0,-0.9; 5 0,0.9
FUSE1 = drill 1.194 long: 1A -10.16,0; 1B -5.08,0; 2A 10.16,0; 2B 5.08,0
SIM900_SMT = smd 2 x 0.6: P$1 -12.4,8; P$2 -12.4,7; P$3 -12.4,6; P$4 -12.4,5; P$5 -12.4,4; P$6 -12.4,3; P$7 -12.4,2; P$8 -12.4,1; P$9 -12.4,0; P$10 -12.4,-1; P$11 -12.4,-2; P$12 -12.4,-3; P$13 -12.4,-4; P$14 -12.4,-5; P$15 -12.4,-6; P$16 -12.4,-7; P$17 -12.4,-8; P$35 12.4,-8; P$36 12.4,-7; P$37 12.4,-6; P$38 12.4,-5; P$39 12.4,-4; P$40 12.4,-3; P$41 12.4,-2; P$42 12.4,-1; P$43 12.4,0; P$44 12.4,1; P$45 12.4,2; P$46 12.4,3; P$47 12.4,4; P$48 12.4,5; P$49 12.4,6; P$50 12.4,7; P$51 12.4,8 | smd 0.6 x 2: P$18 -8,-12.4; P$19 -7,-12.4; P$20 -6,-12.4; P$21 -5,-12.4; P$22 -4,-12.4; P$23 -3,-12.4; P$24 -2,-12.4; P$25 -1,-12.4; P$26 0,-12.4; P$27 1,-12.4; P$28 2,-12.4; P$29 3,-12.4; P$30 4,-12.4; P$31 5,-12.4; P$32 6,-12.4; P$33 7,-12.4; P$34 8,-12.4; P$52 8,12.4; P$53 7,12.4; P$54 6,12.4; P$55 5,12.4; P$56 4,12.4; P$57 3,12.4; P$58 2,12.4; P$59 1,12.4; P$60 0,12.4; P$61 -1,12.4; P$62 -2,12.4; P$63 -3,12.4; P$64 -4,12.4; P$65 -5,12.4; P$66 -6,12.4; P$67 -7,12.4; P$68 -8,12.4
SO16 = smd 0.66 x 2.032: 1 -4.445,-3.073; 2 -3.175,-3.073; 3 -1.905,-3.073; 4 -0.635,-3.073; 5 0.635,-3.073; 6 1.905,-3.073; 7 3.175,-3.073; 8 4.445,-3.073; 9 4.445,3.073; 10 3.175,3.073; 11 1.905,3.073; 12 0.635,3.073; 13 -0.635,3.073; 14 -1.905,3.073; 15 -3.175,3.073; 16 -4.445,3.073
MA08-2 = drill 1.016 octagon: 1 -8.89,-1.27; 2 -8.89,1.27; 3 -6.35,-1.27; 4 -6.35,1.27; 5 -3.81,-1.27; 6 -3.81,1.27; 7 -1.27,-1.27; 8 -1.27,1.27; 9 1.27,-1.27; 10 1.27,1.27; 11 3.81,-1.27; 12 3.81,1.27; 13 6.35,-1.27; 14 6.35,1.27; 15 8.89,-1.27; 16 8.89,1.27
SIMHOLDER = smd 2 x 1.2: C1 -12.61,-3.81; C2 -12.61,-1.27; C3 -12.61,1.27; C5 12.61,-3.81; C6 12.61,-1.27; C7 12.61,1.27
WIRE_HOLE-14AWG = drill 2.54 pad 5.08 octagon: P$1 0,0
G5LE = drill 1.321 long: 1 -7.493,-5.969; 2 -7.493,5.969; O 4.699,5.969; P -9.525,0; S 4.699,-5.969
CHIPLED_0805 = smd 1.2 x 1.2: A 0,-1.05; C 0,1.05
AK300/7 = drill 1.321 long: 1 -15.011,0; 2 -10.008,0; 3 -5.004,0; 4 0,0; 5 5.004,0; 6 10.008,0; 7 15.011,0
RASPBERRY_PI_B+ = drill 1.016 octagon: 1 8.37,51.23; 2 8.37,53.77; 3 10.91,51.23; 4 10.91,53.77; 5 13.45,51.23; 6 13.45,53.77; 7 15.99,51.23; 8 15.99,53.77; 9 18.53,51.23; 10 18.53,53.77; 11 21.07,51.23; 12 21.07,53.77; 13 23.61,51.23; 14 23.61,53.77; 15 26.15,51.23; 16 26.15,53.77; 17 28.69,51.23; 18 28.69,53.77; 19 31.23,51.23; 20 31.23,53.77; 21 33.77,51.23; 22 33.77,53.77; 23 36.31,51.23; 24 36.31,53.77; 25 38.85,51.23; 26 38.85,53.77; 27 41.39,51.23; 28 41.39,53.77; 29 43.93,51.23; 30 43.93,53.77; 31 46.47,51.23; 32 46.47,53.77; 33 49.01,51.23; 34 49.01,53.77; 35 51.55,51.23; 36 51.55,53.77; 37 54.09,51.23; 38 54.09,53.77; 39 56.63,51.23; 40 56.63,53.77 | drill 2.75 pad 6.2: PE_BL 3.5,3.5; PE_BR 61.5,3.5; PE_TL 3.5,52.5; PE_TR 61.5,52.5
TC38H = drill 0.813: 1 -1.27,0; 2 1.27,0
R0805 = smd 1.3 x 1.5: 1 -0.85,0; 2 0.85,0
0309/10 = drill 0.813 octagon: 1 -5.08,0; 2 5.08,0
SOLDERJUMPER_ARROW_NOPASTE = smd 0.762 x 1.524: 1 -1.016,0; 2 1.016,0
SOLDERJUMPER_CLOSEDWIRE = smd 1.168 x 1.6: 1 -0.762,0; 2 0.762,0 | smd 0.635 x 0.203: WIRE 0,0
SOT23-BEC = smd 1 x 1.4: B -0.95,-1.1; C 0,1.1; E 0.95,-1.1
SOIC8_150MIL = smd 0.6 x 2.2: 1 -1.905,-2.6; 2 -0.635,-2.6; 3 0.635,-2.6; 4 1.905,-2.6; 5 1.905,2.6; 6 0.635,2.6; 7 -0.635,2.6; 8 -1.905,2.6
RHT03_DHT-22 = drill 0.8: DATA -1.27,0; GND 3.81,0; NULL 1.27,0 | drill 0.8 octagon: VDD -3.81,0
ARDUINO_PRO_MINI = drill 1.016 pad 1.88: 1 -7.62,12.7; 2 -7.62,10.16; 3 -7.62,7.62; 4 -7.62,5.08; 5 -7.62,2.54; 6 -7.62,0; 7 -7.62,-2.54; 8 -7.62,-5.08; 9 -7.62,-7.62; 10 -7.62,-10.16; 11 -7.62,-12.7; 12 -7.62,-15.24; 13 7.62,-15.24; 14 7.62,-12.7; 15 7.62,-10.16; 16 7.62,-7.62; 17 7.62,-5.08; 18 7.62,-2.54; 19 7.62,0; 20 7.62,2.54; 21 7.62,5.08; 22 7.62,7.62; 23 7.62,10.16; 24 7.62,12.7; 25 -1.27,-15.24; 26 -3.81,-15.24; 27 3.81,-15.24; 28 1.27,-15.24
SO08 = smd 0.61 x 2.21: 1 -1.905,-2.616; 2 -0.635,-2.616; 3 0.635,-2.616; 4 1.905,-2.616; 5 1.905,2.616; 6 0.635,2.616; 7 -0.635,2.616; 8 -1.905,2.616
L0603 = smd 1.1 x 1: 1 -0.85,0; 2 0.85,0
DCDCMODULE-SMALL = drill 1.2 pad 2.184: INM#1 1.8,15; INM#2 1.8,12.5; OUTM#1 20.3,15; OUTM#2 20.3,12.5 | drill 1.2 pad 2.184 square: INP#1 1.8,4.3; INP#2 1.8,1.8; OUTP#1 20.3,4.3; OUTP#2 20.3,1.8
TV16 = drill 1 pad 1.93: IA -5.08,-6.35; IB -5.08,6.35; OA 5.08,6.35; OB 5.08,-6.35
SMA90_DIP = drill 1.5 pad 2.54: ANTENNA 0,0 | drill 1.6 pad 2.54: GND1 -2.54,2.54; GND2 2.54,2.54; GND3 -2.54,-2.54; GND4 2.54,-2.54

### Placement (x,y rotation side)
BAT1  76.75,23.25 0 bottom
BI_REG_A  95,100.5 180 top
BI_REG_B  85,100.5 180 top
BI_SPLY_A  9,48 270 top
BI_SPLY_B  9,58 270 top
C1  79.5,15.75 270 bottom
C3  33,87 270 top
C4  36.5,87 270 top
C5  41,75.75 180 top
C6  41,72.5 180 top
C7  140.25,11.5 90 top
C8  145.75,19.5 90 top
C9  116.75,27 90 bottom
C10  97.25,12 90 bottom
C11  97.25,8 270 bottom
C12  106.25,12 90 bottom
C13  106.25,8 270 bottom
C14  44,91 90 bottom
D1  -16.25,-26 0 top  (outside the outline)
D3  101.75,9 270 bottom
F1  66,89 0 top
F2  90,89 0 top
F3  114,89 0 top
F4  25,38 270 top
IC1  126.75,28.5 270 top
IC2  127.75,70.75 90 top
INDICATOR_CONN  140.75,71 90 top
J1  101.75,17 90 top
J2  25,23.5 0 top
J3  46,78.75 0 top
J4  18.75,56.25 0 top
J5  101,100.25 0 top
J6  18.75,63.75 0 top
J7  125,100.25 0 top
K1  10.5,-14 0 top  (outside the outline)
LED1  140.75,49.5 180 top
LED2  145.75,49.5 180 top
MDM_REG_A  71,100.5 180 top
MDM_REG_B  61,100.5 180 top
MDM_SPLY  9,24.25 270 top
PCB1  87,59 180 top
Q1  73,20.5 0 bottom
R1  128.75,53.25 90 bottom
R2  38,25.25 180 bottom
R3  38,22.75 0 bottom
R4  57,43 180 bottom
R6  29,82.75 90 bottom
R7  34.75,73.75 90 bottom
R8  35.25,81.25 0 bottom
R10  97.5,96 270 bottom
R11  95,96 90 bottom
R12  100.25,85 270 bottom
R13  98,85 90 bottom
R14  38,43 180 bottom
R15  38,40.5 0 bottom
R16  121.5,96 270 bottom
R17  119,96 90 bottom
R18  103,2.75 90 bottom
R19  100.5,2.75 90 bottom
R20  101.75,12.5 270 top
R21  142,40.25 180 top
R22  142,42.5 180 top
R23  143,49.5 270 top
R24  147,40.25 180 top
R25  147,42.5 180 top
R26  148,49.5 270 top
R27  130.5,44.5 90 top
R28  38,61.75 180 bottom
R29  38,59.25 0 bottom
R30  93.75,78 270 top
R31  93.75,74 270 top
R32  28.5,97.5 270 bottom
R33  44,99 90 top
R34  57,40.5 0 bottom
R35  43.62,14 180 top
R36  43.62,12 180 top
R37  145.25,62.25 0 bottom
R38  145.25,64.75 0 bottom
R39  145.25,67.25 0 bottom
R40  145.25,69.75 0 bottom
R41  145.25,72.25 0 bottom
R42  145.25,74.75 0 bottom
R43  145.25,77.25 0 bottom
R44  136,62.25 180 bottom
R45  136,64.75 180 bottom
R46  136,67.25 180 bottom
R47  93,66 180 bottom
R48  136,69.75 180 bottom
R49  136,72.25 180 bottom
R50  136,74.75 180 bottom
R51  136,77.25 180 bottom
SCADA_REG_A  119,100.5 180 top
SCADA_REG_B  109,100.5 180 top
SCADA_SPLY  9,68 270 top
SJ1  73.5,71 0 bottom
SJ2  79.75,50 270 top
SJ3  43.88,87.88 180 bottom
T1  142,45.5 0 top
T2  147,45.5 0 top
T3  133.5,44.5 270 top
T4  25.75,82.75 180 bottom
U1  75.5,15.5 180 bottom
U3  126.25,55.75 90 top
U$1  104.25,63.5 0 top
U$2  35.25,81.25 0 top
U$4  34.75,73.75 270 top
U$5  140.5,18 180 top
U$6  56.25,66.75 0 top
U$7  56.25,48.75 0 top
U$8  66,40 90 bottom
U$9  36.25,99 0 top
U$10  54.75,63.5 180 top
U$11  54.75,27 180 top
U$13  54.75,44.75 180 top
V_ACCU  9,79.5 270 top
V_PWR_SPLY  14.5,91 270 top
VAC  14.5,102.5 270 top
X1  145.75,28.5 270 top

### Tracks (layer width: path | path; a pad name or v marks a point on that pad's centre or on a via)
+3V3  (via drill 0.6)
  Top 0.813: R23.1 143,52 | 143,52 147.25,52 148,51.25 v148,50.5 R26.1 | 143,52 139.25,52 v138,50.75 | U$5.2 v139,18 | SJ2.2 79.75,48.5
  Top 1.676: 79.75,48.5 79.75,47.75 82.5,45 125.75,45 131.5,50.75 v138,50.75
  Bottom 0.813: v139,18 138,18 135.75,20.25 135.75,25 135,25.75 132.75,25.75 132,26.5 132,30.5 132.75,31.25 135.25,31.25 135.75,31.75 135.75,36.25 138,38.5 v138,50.75 132,56.75 132,60.25 134,62.25 R44.1 | R38.1 R37.1 146.1,62.15 148,60.25 v148,50.5
+5V  (via drill 0.6)
  Top 0.406: IC2.16 124.56,66.31 v124.5,66.25
  Top 0.813: U$2.8 33.34,85.66 C3.2 31.75,86 31.12,86.62 31.12,88.88 34.38,92.12 34.38,96.12 39.5,101.25 39.5,106.12 42.25,108.88 128.62,108.88 133.75,103.75 133.75,96.5 133,95.75 v133,84.75 | U$4.8 39.91,75.66 C5.2 v40,76 | v65,34 v66,34 v67,34 | 114.25,83.5 114.25,69.75 113,68.5 111.95,68.5 U$1.21 | 114.25,83.5 113,84.75 90,84.75 | 90,84.75 80.25,84.75 79,83.5 79,78 77.75,76.75 72.25,76.75 71,75.5 v71,72 | 114.25,83.5 115.5,84.75 v122.25,84.75 v123.25,84.75 v124.25,84.75 | v134,84.75 v133,84.75 | v132,84.75 v133,84.75 | 90,84.75 90.25,84.5 v90.25,82.75
  Top 1.676: v71,71 68,71 66,69 v66,34 | v71,72 v71,71 | v71,71 v71,70
  Bottom 0.406: R46.1 132.25,67.25 128.25,63.25 | R45.1 132.75,64.75 131.25,63.25 128.25,63.25 | R48.1 131.75,69.75 125.25,63.25 | 125.25,63.25 128.25,63.25 | 128.25,63.25 128.25,56 128.75,55.5 129.5,55.5 130,55 130,52.75 129.65,52.4 R1.1 | v124.5,66.25 125.25,65.5 125.25,63.25
  Bottom 0.813: U1.8 73.59,14.35 74.25,15 79.4,15 C1.2 80.85,14.9 | v40,76 40,80.25 40.75,81 40.75,84.62 39.38,86 C3.2 | 72,71 SJ1.2 | U$8.16 66.81,35.55 66,34.75 v66,34 | R39.1 R40.1 R41.1 R42.1 R43.1 146,77.35 146,79.25 145.36,79.89 INDICATOR_CONN.15 142,79.91 142,80.75 141,81.75 137.25,81.75 | R48.1 R49.1 R50.1 R51.1 135.15,79.65 137.25,81.75 | 137.25,81.75 137,81.75 v134,84.75 v122.25,84.75 | R1.1 126.71,52.4 U3.VDD | R47.1 92.15,66.1 90.25,68 v90.25,82.75
  Bottom 1.676: PCB1.4 PCB1.2 78.63,4.12 81,1.75 86.25,1.75 88.25,3.75 88.25,14.25 | v71,71 72,71 | 88.25,14.25 88.25,31.25 85.5,34 v66,34 v65,34 | 80.85,14.9 87.6,14.9 88.25,14.25
  other vias: 33,86
+6.5V
  Bottom 0.813: U$13.OUTP#2 37.1,42.95 R14.1
  Bottom 1.676: MDM_SPLY.6 24.5,14.25 29,18.75 29,21.5 31,23.5 31,37 U$13.OUTP#1 U$13.OUTP#2
+13.5V
  Bottom 0.813: U$10.OUTP#2 37.1,61.7 R28.1
  Bottom 1.676: MDM_SPLY.2 5.99,34.26 5,35.25 5,41 6.25,42.25 15,42.25 18.25,45.5 26.5,45.5 31,50 31,55.75 U$10.OUTP#1 U$10.OUTP#2
+19.5V
  Bottom 0.813: U$11.OUTP#2 37.1,25.2 R2.1
  Bottom 1.676: MDM_SPLY.7 9.51,9.75 21.5,9.75 23.25,11.5 26.25,11.5 31.75,17 31.75,20 U$11.OUTP#1 U$11.OUTP#2
AGND  (via drill 0.6)
  Top 0.813: U$2.5 38.25,84.96 38.25,87.25 37.5,88 C4.1 v36.38,88 | U$4.5 38.46,70.75 41.25,70.75 42,71.5 C6.1 C5.1 v42,76 | C3.1 v32.88,88
  Bottom 0.813: v32.88,88 v36.38,88 39.5,88 42,85.5 | v42,76 42,85.5 | C14.1 44.64,89.36 SJ3.2 44.64,86.26 43.88,85.5 42,85.5
ARDU_FLASH  (via drill 0.6)
  Top 0.406: v131.75,62.25 124.5,62.25 113.05,50.8 U$1.14
  Bottom 0.406: INDICATOR_CONN.4 138.9,64.65 137.75,63.5 133,63.5 v131.75,62.25
  Bottom 0.813: R45.2 139.38,64.75 INDICATOR_CONN.4
ARDU_RX  (via drill 0.6)
  Top 0.813: v61.5,30.25 68.5,30.25 70.5,32.25 70.5,55.75 71.75,57 78.5,57 80.75,59.25 80.75,72.25 81.75,73.25 v91.75,73.25
  Bottom 0.61: 60.75,22 60.75,19.75 57.75,16.75 47.75,16.75 46.25,15.25
  Bottom 0.813: PCB1.31 40.53,9.53 46.25,15.25 | 60.75,22 60.75,29.5 v61.5,30.25 | v91.75,73.25 96.22,73.25 U$1.2
ARDU_TX  (via drill 0.6)
  Top 0.813: R30.2 R31.1 80.1,74.85 79,73.75 79,60 77.75,58.75 71,58.75 68.75,56.5 68.75,33 67.75,32 v61,32
  Bottom 0.61: 59,22 59,20.25 56.75,18 46.75,18 45.5,16.75
  Bottom 0.813: PCB1.33 37.99,9.24 45.5,16.75 | 59,22 59,30 v61,32
CTRL_CHARGING  (via drill 0.6)
  Top 0.813: v29,81.75 25.88,81.75 24.88,82.75 24.88,86.75 23.88,87.75 21.12,87.75 20.12,86.75 20.12,80.5 19.12,79.5 5.62,79.5 5,78.88 5,6.5 9,2.5 27.64,2.5 PCB1.40
  Bottom 0.813: R6.1 v29,81.75
CTRL_LED0
  Top 0.406: IC2.15 127.17,67.58 129.5,65.25 132.25,65.25 133.5,64 133.5,59.75 137.25,56 144.25,56 148,59.75 148,72.5 143.25,77.25 142.12,77.25 INDICATOR_CONN.13
  Bottom 0.813: R43.2 142.12,77.25 INDICATOR_CONN.13
CTRL_LED1
  Top 0.406: IC2.1 133.94,66.31 134.25,66 134.25,60 137.5,56.75 144,56.75 147.25,60 147.25,72 143.12,76.12 140.71,76.12 INDICATOR_CONN.14
  Bottom 0.813: INDICATOR_CONN.14 136.95,77.35 R51.2
CTRL_LED2
  Top 0.406: INDICATOR_CONN.11 142.08,74.75 143.25,74.75 146.5,71.5 146.5,60.25 143.75,57.5 137.75,57.5 135,60.25 135,66.5 133.93,67.58 IC2.2
  Bottom 0.813: R42.2 142.08,74.75 INDICATOR_CONN.11
CTRL_LED3
  Top 0.406: INDICATOR_CONN.12 140.79,73.5 143.25,73.5 145.75,71 145.75,60.5 143.5,58.25 138,58.25 135.75,60.5 135.75,67 133.91,68.84 IC2.3
  Bottom 0.813: INDICATOR_CONN.12 136.91,74.81 R50.2
CTRL_LED4
  Top 0.406: INDICATOR_CONN.9 142.04,72.25 143.25,72.25 145,70.5 145,60.75 143.25,59 138.25,59 136.5,60.75 136.5,67.5 133.88,70.11 IC2.4
  Bottom 0.813: R41.2 142.04,72.25 INDICATOR_CONN.9
CTRL_LED5
  Top 0.406: INDICATOR_CONN.10 140.75,71 143.25,71 144.25,70 144.25,61 143,59.75 138.5,59.75 137.25,61 137.25,68 133.87,71.39 IC2.5
  Bottom 0.813: INDICATOR_CONN.10 136.87,72.27 R49.2
CTRL_LED6
  Top 0.406: INDICATOR_CONN.7 142.04,69.75 143.25,69.75 143.5,69.5 143.5,61.25 142.75,60.5 138.75,60.5 138,61.25 138,68.5 133.84,72.66 IC2.6
  Bottom 0.813: R40.2 142.04,69.75 INDICATOR_CONN.7
CTRL_LED7
  Top 0.406: IC2.7 133.82,73.92 138,69.75 139.46,69.75 INDICATOR_CONN.8
  Bottom 0.813: R48.2 139.46,69.75 INDICATOR_CONN.8
CTRL_LED8  (via drill 0.6)
  Top 0.406: v130.75,64.25 129.75,63.25 123,63.25 113.09,53.34 U$1.15
  Bottom 0.406: INDICATOR_CONN.5 142.02,67.02 140.94,65.94 132.44,65.94 v130.75,64.25
  Bottom 0.813: R39.2 142.08,67.25 INDICATOR_CONN.5
CTRL_LED9  (via drill 0.6)
  Top 0.406: v127.75,64.25 121.5,64.25 113.13,55.88 U$1.16
  Bottom 0.406: INDICATOR_CONN.6 139.44,67.19 138.12,68.5 132,68.5 v127.75,64.25
  Bottom 0.813: R46.2 139.42,67.25 INDICATOR_CONN.6
CTRL_SIM_PWRKEY  (via drill 0.6)
  Top 0.813: PCB1.11 66.02,7.77 72,13.75 81.25,13.75 82.75,15.25 82.75,24.75 v90.25,32.25 | v129.25,43.75 130.4,43.75 R27.1
  Bottom 0.813: v90.25,32.25 102,44 129,44 v129.25,43.75
DHT_DATA
  Top 0.813: U$1.13 118.51,48.26 124.75,54.5 126.23,54.5 U3.DATA
  Bottom 0.813: U3.DATA 128.37,54.48 R1.2
GND  (via drill 0.6)
  Top 0.406: IC1.P$17 116.15,40.9 114.35,39.1 IC1.P$18 | IC1.P$39 122.75,17.5 | 122.75,17.5 122.25,18 117.5,18 117,18.5 v117,26 116.5,25.5 IC1.P$29 112.75,25.5 112.25,26 | 122.75,17.5 123.25,18 128.25,18 128.75,17.5 IC1.P$45 IC1.P$46 | IC1.P$53 IC1.P$54 | IC1.P$59 IC1.P$58 137.75,26.5 | IC1.P$65 139.15,33 IC1.P$64 IC1.P$63 IC1.P$62 IC1.P$61 137.75,29.5 137.25,29 137.25,27 137.75,26.5 | 137.75,26.5 137.25,26 137.25,22.75 137.5,22.5
  Top 0.813: v42.88,88.25 42.75,88.25 50.75,96.25 56.75,96.25 | U$1.4 95.17,68.58 93.75,70 R31.2 | v121.88,68.88 123.11,70.11 IC2.13 127.11,70.11 127.75,70.75 127.75,74.5 128.44,75.19 IC2.8 133.69,75.19 138.39,79.89 INDICATOR_CONN.16 | U$1.23 111.34,73.66 109.75,75.25 v109.75,83.25 108.75,82.25 v97.75,82.25 v92.75,82.25 | BAT1.2 v90,23.25 | IC1.P$63 142.75,31.5 X1.GND3 X1.GND1 | IC1.P$58 142.67,26.5 X1.GND4 X1.GND2 | IC1.P$62 140.5,30.5 v141,30 | T1.E 142.95,42.6 | 142.95,42.6 R22.1 | T2.E 147.95,42.6 R25.1 149,42.5 149.5,42 149.5,39.25 149,38.75 144.5,38.75 | C8.- 145.75,13 141.5,8.75 140.3,8.75 C7.- 129.5,8.8 | 142.95,42.6 143.9,42.6 144.5,42 144.5,38.75 | T3.E 132.7,43.55 133.25,43 135,43 137,41 137,34 138,33 139.15,33 141.75,33 144.5,35.75 144.5,38.75 | IC1.P$54 137.5,22.5 134.75,22.5 129.75,17.5 IC1.P$46 129.75,9.05 129.5,8.8 | 112.25,29.75 112.25,36 112.75,36.5 IC1.P$18 | J1.C5 112.11,29.61 112.25,29.75 | 112.25,26 112.25,29.75 | 129.5,8.8 105.8,8.8 | 105.8,8.8 v105.75,8.75 | 105.8,8.8 105.8,10.7 v105.75,10.75 | v81.25,23.25 79,25.5 57.2,25.5 U$13.INM#1
  Top 1.676: U$13.INM#1 U$13.OUTM#1 34.45,29.55 38.75,25.25 38.75,19.25 | U$10.INM#1 U$10.OUTM#1 34.45,48.3 38.75,44 38.75,36.55 U$13.OUTM#2 | 38.75,19.25 38.75,18.8 U$11.OUTM#2 U$11.OUTM#1 | SCADA_REG_A.2 116.51,98.26 114.5,96.25 87.75,96.25 | V_PWR_SPLY.1 21.48,93.52 26.75,88.25 v26.75,83.75 | U$6.OUTM#2 U$6.INM#2 | U$13.INM#2 53,32.25 56.25,35.5 v56.25,40.5 59,43.25 v62.5,43.25 62.5,56.8 U$7.INM#2 | 38.75,19.25 48.2,19.25 U$11.INM#2 U$11.INM#1 | 87.75,96.25 68.5,96.25 | 68.5,96.25 56.75,96.25 | MDM_REG_A.2 68.51,96.26 68.5,96.25 | BI_REG_B.1 87.52,96.48 87.75,96.25
  Bottom 0.406: U$8.8 U$8.7 | U$8.7 U$8.6 | v62.5,43.25 62.85,43.25 U$8.7 | v117,26 116.85,26.15 C9.1 | D3.2 106.1,9 C13.1
  Bottom 0.813: R29.2 37.15,57.9 34.5,55.25 34.5,51.05 U$10.OUTM#2 | R15.2 37.15,38.9 34.5,36.25 34.5,32.3 U$13.OUTM#2 | R3.2 37.15,21.15 34.5,18.5 34.5,14.55 U$11.OUTM#2 | R17.2 116.51,99.34 SCADA_REG_A.2 | R11.2 93.35,96.85 | T4.E 26.75,83.8 v26.75,83.75 26.75,83.5 27.12,83.12 27.12,80.88 27.88,80.12 30.12,80.12 31.25,81.25 31.38,81.25 | C1.1 79.5,17.25 78.65,18.1 U1.4 77.41,22.41 78.25,23.25 v81.25,23.25 BAT1.2 | 31.38,81.25 R8.2 | SJ3.1 43.11,88.14 | 31.38,81.25 31.38,88.88 32,89.5 41.62,89.5 v42.88,88.25 42.88,88.11 SJ3.1 | SJ3.1 43.11,87.99 | v56.25,40.5 R34.2 | U$1.23 117.09,73.66 v121.88,68.88 121.88,63.94 U3.GND | U$1.4 97.33,68.58 98.75,70 98.75,75.25 106.75,83.25 v109.75,83.25 | C13.1 C12.1 105.75,11.15 | C11.1 C10.1 95.85,11.15 95.25,11.75 95.25,14.25 95.88,14.88 | 95.88,14.88 96,15 103.25,15 104,14.25 104,12 104.85,11.15 105.75,11.15 | v90,23.25 90.25,23.25 95.25,18.25 95.25,15.5 95.88,14.88 | v105.75,8.75 v105.75,9.75 v105.75,10.75 105.75,11.15 | R13.2 96.35,85.85 95.75,85.25 95.75,83.75 97.25,82.25 v97.75,82.25 | 93.35,96.85 91.25,94.75 91.25,83.75 v92.75,82.25 | 93.35,96.85 93.35,96.91 92.51,97.75 BI_REG_A.2
  Bottom 1.676: V_PWR_SPLY.1 14.48,93.5 11.25,93.5 9,91.25 V_ACCU.1 8.98,82 6.25,82 5,80.75 5,65.5 | 5,65.5 5,55.5 | 5,55.5 5,46.75 5.25,46.5 | 5.25,46.5 6.25,45.5 BI_SPLY_A.2 | BI_SPLY_B.2 5.01,55.51 5,55.5 | SCADA_SPLY.2 5.01,65.51 5,65.5 | MDM_SPLY.4 7.5,24.25 2,29.75 2,43.25 5.25,46.5 | U$13.OUTM#2 U$13.OUTM#1 | U$10.OUTM#2 U$10.OUTM#1 | U$10.INM#2 U$10.INM#1 | SCADA_REG_B.1 SCADA_REG_A.2 | U$6.INM#2 U$6.INM#1 58.05,82.05 58.5,82.5 58.5,91.75 63.5,96.75 63.5,100.48 | U$6.OUTM#1 U$6.OUTM#2 77.75,79.25 79.75,77.25 79.75,65.5 78,63.75 U$7.OUTM#1 | U$7.INM#2 U$7.INM#1 U$7.OUTM#1 | U$7.OUTM#1 U$7.OUTM#2 | U$13.INM#2 U$13.INM#1 | PCB1.39 30.37,9.87 32.5,12 U$11.OUTM#1 | PCB1.25 48.15,9.15 51,12 U$11.INM#1 65.75,12 68.47,9.28 PCB1.9 | 63.5,100.48 68.5,100.48 MDM_REG_A.2 | 63.5,100.48 MDM_REG_B.1 | BI_REG_A.2 BI_REG_B.1
  pour Top (isolate 0.406): 110.5,46.25 110.5,28 110.5,7.25 110.5,5.75 150,5.75 150,53 131.75,53 125,46.25
  pour Bottom (isolate 0.813): 7,96.25 7,86 0,86 0,0 150,0 150,110 37.75,110 37.75,89 24.25,89 24.25,96.25
MDM_INDC_0
  Top 0.813: 9.03,29.23 MDM_SPLY.3 11.75,29.25 30,11 32.25,11 35.45,7.8 PCB1.35 39.68,12 R36.2
MDM_INDC_1  (via drill 0.6)
  Top 0.813: PCB1.37 32.91,7.84 31.25,9.5 29.25,9.5 19.5,19.25 MDM_SPLY.5 9.03,19.27 | R35.2 39.5,14 v35.75,10.25
  Bottom 0.813: v35.75,10.25 33.27,7.77 PCB1.37
N$1
  Bottom 2.54: VAC.2 25.93,100.01 R32.1
N$2
  Bottom 2.54: VAC.1 14.52,105.02 17.5,108 28.52,108 U$9.IB
N$3
  Bottom 0.813: U1.1 73.59,18.64 Q1.2
N$4
  Bottom 0.813: U1.2 74.86,19.91 Q1.1
N$5
  Bottom 0.813: U1.3 76.14,22.36 75.25,23.25 BAT1.1
N$6
  Bottom 0.813: U$8.13 67.61,39.37 67,38.75 67,37.5 67.67,36.83 U$8.15
N$7
  Bottom 0.813: U$8.4 65.36,39.37 66.64,40.63 U$8.12
N$8
  Bottom 1.676: U$6.OUTP#2 U$6.OUTP#1 74.57,71.05 SJ1.1
N$9
  Top 1.676: U$7.OUTP#1 78.7,53.05 79.75,52 SJ2.1
  Bottom 1.676: U$7.OUTP#1 U$7.OUTP#2
N$10
  Top 0.813: U$2.6 35.88,85.39 C4.2
N$12
  cutout Bottom (isolate 0.61): 7,110 36,110 36,90.5 26.25,90.5 25.5,91.25 25.5,97.25 24.75,98 7,98
N$13
  Bottom 0.813: T4.B 24.8,84.8 25.5,85.5 28.25,85.5 29,84.75 R6.2
N$16
  Top 0.813: U$4.6 39.38,73.11 C6.2
N$17
  Bottom 1.676: F1.1A 55.84,93.34
  Bottom 2.54: MDM_REG_B.2 56.38,98.37 55.84,97.83 55.84,93.34
N$18
  Bottom 2.54: F2.1A 79.84,97.83 BI_REG_B.2
N$19
  Bottom 2.54: SCADA_REG_B.2 106.51,91.67 F3.1A
N$20
  Bottom 0.813: F4.1A 25,48.25 24.25,49
  Bottom 3.81: 24.25,49 22.75,50.5 9.02,50.5 BI_SPLY_A.1
N$21
  Top 0.406: IC1.P$60 140.5,28.5
  Top 0.813: 140.5,28.5 X1.ANTENNA
N$22
  Top 0.406: IC1.P$57 IC1.P$56 IC1.P$55 140.5,23.5
  Top 0.813: 140.5,23.5 145.25,23.5 145.75,23 C8.+ 145.75,21.25 142.5,18 U$5.1 141.35,16.1 140.25,15 C7.+
N$23  (via drill 0.6)
  Top 0.406: IC1.P$26 116.5,28.5 v117,28
  Bottom 0.406: C9.2 116.85,27.85 v117,28
N$24  (via drill 0.6)
  Top 0.406: IC1.P$33 113.5,21.5
  Top 0.813: 113.5,21.5 v112.75,21.5
  Bottom 0.813: v112.75,21.5 112.75,5.75 109.25,2.25 104,2.25 103.65,1.9 R18.1
N$25  (via drill 0.6)
  Top 0.406: IC1.P$32 115.25,22.5
  Top 0.813: 115.25,22.5 v116,22.5
  Bottom 0.406: 105.5,0.75 104.5,0.75 104.25,0.5 101,0.5 100.5,1 R19.1
  Bottom 0.813: 105.5,0.75 109.75,0.75 116,7 v116,22.5
N$26
  Top 0.406: IC1.P$31 110.5,23.5
  Top 0.813: R20.1 101.75,21.75 103.5,23.5 110.5,23.5
N$27
  Top 0.813: LED1.C 140.75,47.85 T1.C
N$28
  Top 0.406: R23.2 142.65,48.65 LED1.A
N$29
  Top 0.813: LED2.C 145.75,47.85 T2.C
N$30
  Top 0.813: T1.B 141.05,42.6 R22.2 R21.2
N$31
  Top 0.406: R26.2 147.65,48.65 LED2.A
N$32
  Top 0.813: T2.B 146.05,42.6 R25.2 R24.2
N$33
  Top 0.813: T3.B 130.6,45.45 R27.2
N$34  (2 unrouted)
N$35
  Top 0.813: U$1.1 96.63,77.62 95.5,78.75 93.85,78.75 R30.1
N$36
  Bottom 2.54: R32.2 30.94,92.42 U$9.IA
N$38
  Bottom 0.813: U$9.OB 42.6,93.92 R33.1 C14.2
RPI_3V3
  Top 0.813: R35.1 R36.1 44.5,11.97 44.5,10.75 45.5,9.75 56.5,9.75 58.31,7.94 PCB1.17
RPI_FLASH  (via drill 0.6)
  Top 0.406: 123,58.75 125.5,61.25 131,61.25 137.25,55 v143.25,55
  Top 0.813: PCB1.13 63.25,7.91 v63.25,13.75 | v89,34.5 v85.5,31 | v115.75,51.5 123,58.75
  Bottom 0.406: INDICATOR_CONN.3 142.02,64.27 140.75,63 140.75,58.25 143.25,55.75 v143.25,55
  Bottom 0.813: v63.25,13.75 62.5,14.5 62.5,27.5 63.5,28.5 83,28.5 v85.5,31 | v89,34.5 100.5,46 113.25,46 114.25,47 114.25,50 v115.75,51.5 | R38.2 142.12,64.75 INDICATOR_CONN.3
RTC_SCL
  Bottom 0.813: U1.6 76.14,10.36 PCB1.5
RTC_SDA
  Bottom 0.813: U1.5 77.41,9.09 PCB1.3
SEL_SENSOR_1
  Bottom 0.813: U$8.11 81.91,41.91 88.12,48.12 88.5,48.5 90.8,50.8 U$1.11
SEL_SENSOR_2
  Bottom 0.813: U$8.10 81.17,43.17 91.34,53.34 U$1.10
SEL_SENSOR_3
  Bottom 0.813: U$8.9 80.44,44.45 91.88,55.88 U$1.9
SENSOR_BUC  (via drill 0.6)
  Top 0.813: v100.25,80.5 100.25,77.25 105.5,72 105.5,48.28 U$1.28
  Bottom 0.813: R13.1 99.75,84.15 | 99.75,84.15 R12.2 v100.25,80.5 | 99.85,84.25 99.75,84.15
SENSOR_IBAT  (via drill 0.6)
  Top 0.813: v37.75,74.38 37.38,74.38 U$4.7 | v38.88,81 40.75,82.88 40.75,88.5 38.12,91.12 38.12,94.25 42.38,98.5 51.5,98.5 56.88,103.88 126.62,103.88 128.75,101.75 128.75,98.5 126.75,96.5 126.75,84.25 125.75,83.25 116.5,83.25 115.75,82.5 115.75,68.25 113.5,66 111.91,66 U$1.20
  Bottom 0.813: v37.75,74.38 37.75,79.88 v38.88,81
SENSOR_ILOAD
  Top 0.813: U$2.7 34.62,89.61 35.62,90.62 35.62,95.5 41.12,101 50.5,101 55.88,106.38 127.62,106.38 131.25,102.75 131.25,97.5 129.25,95.5 129.25,82.5 127,80.25 119.25,80.25 118.75,79.75 118.75,66 113.75,61 111.91,61 U$1.18
SENSOR_MDM
  Bottom 0.813: U$8.14 90.28,38.09 U$1.26
SENSOR_MDM_0
  Bottom 0.61: 55.5,22 55.5,21 55,20.5 43.75,20.5
  Bottom 0.813: R14.2 R15.1 40.5,38.85 40.5,23.75 43.75,20.5 | U$8.2 56.08,36.83 55.5,36.25 55.5,22
SENSOR_MDM_1  (via drill 0.6)
  Top 0.813: v58,57 v50.5,57
  Bottom 0.813: R28.2 R29.1 41.1,57 v50.5,57 | U$8.5 61.37,40.63 60.5,41.5 60.5,55.75 59.25,57 v58,57
SENSOR_MDM_2
  Bottom 0.61: 57.25,22 57.25,20.75 55.75,19.25 42.25,19.25 42,19.5
  Bottom 0.813: R2.2 R3.1 38.85,22.65 42,19.5 | U$8.1 57.8,35.55 57.25,35 57.25,22
SENSOR_MDM_3
  Bottom 0.813: U$8.3 60.26,38.09 R34.1 R4.2
SENSOR_SCADA  (via drill 0.6)
  Top 0.813: v101.75,80.5 101.75,78 108.25,71.5 108.25,48.45 U$1.27
  Bottom 0.813: R16.2 R17.1 117.9,95.15 113.25,90.5 113.25,86.5 112.25,85.5 106.75,85.5 v101.75,80.5
SENSOR_SCPC  (via drill 0.6)
  Top 0.813: v98.75,80.5 98.75,76.5 103,72.25 103,48.28 U$1.25
  Bottom 0.813: v98.75,80.5 97,80.5 92.75,84.75 92.75,93 94.9,95.15 R11.1 R10.2
SENSOR_VAC
  Top 0.813: R33.2 44.08,104.08 47.62,107.62 128.12,107.62 132.5,103.25 132.5,97 130.5,95 130.5,81.5 127.75,78.75 121,78.75 120.25,78 120.25,65 113.75,58.5 111.95,58.5 U$1.17
  Bottom 0.813: U$9.OA 42.73,105.35 R33.2
SENSOR_VBAT  (via drill 0.6)
  Top 0.813: v36,81.25 37.25,81.25 39.5,83.5 39.5,88 36.88,90.62 36.88,94.88 41.75,99.75 51,99.75 56.38,105.12 127.12,105.12 130,102.25 130,98 128,96 128,83.5 126.25,81.75 118,81.75 117.25,81 117.25,67 113.75,63.5 U$1.19
  Bottom 0.813: R7.2 36.1,75.95 R8.1 v36,81.25
SIM_NETLIGHT  (via drill 0.6)
  Top 0.813: v147.75,40.25 147.75,40.15 R24.1 | IC1.P$52 v137.75,20.5
  Bottom 0.813: v137.75,20.5 137.25,21 137.25,33.5 138.25,34.5 147.25,34.5 147.75,35 v147.75,40.25 146.25,41.75 146.25,57.88 INDICATOR_CONN.1 142.16,62.25 R37.2
SIM_PWRKEY  (via drill 0.6)
  Top 0.813: T3.C v134.75,44.5 | IC1.P$1 v134.75,41.5
  Bottom 0.813: v134.75,41.5 v134.75,44.5
SIM_RX  (via drill 0.6)
  Top 0.406: PCB1.8 71.01,5.51 72.25,6.75 72.25,8.75 73,9.5 | IC1.P$10 125.75,39.75
  Top 0.813: 73,9.5 74.25,10.75 82.75,10.75 v95,23 | 125.75,39.75 v125.75,39.25
  Bottom 0.813: v95,23 111.25,39.25 v125.75,39.25
SIM_STATUS  (via drill 0.6)
  Top 0.406: IC1.P$66 140,34.5 140.5,34.5
  Top 0.813: 140,34.5 141,34.5 142.85,36.35 142.85,39.9 v142.75,40.25 R21.1
  Bottom 0.813: v142.75,40.25 142.75,53.75 139.48,57.02 INDICATOR_CONN.2 139.34,62.25 R44.2
SIM_TX  (via drill 0.6)
  Top 0.406: PCB1.10 68.47,5.47 69.75,6.75 69.75,9 70.25,9.5 | IC1.P$9 126.75,42
  Top 0.813: 70.25,9.5 73,12.25 82,12.25 v92.75,23 | 126.75,42 v126.75,42.5
  Bottom 0.813: v92.75,23 112.25,42.5 v126.75,42.5
SR_DS  (via drill 0.6)
  Top 0.813: IC2.14 123.53,68.84 v123.5,68.88
  Bottom 0.813: v123.5,68.88 123.5,69.5 115,78 110.5,78 104.75,72.25 104.75,65.75 97.42,58.42 U$1.8
SR_RST  (via drill 0.6)
  Top 0.813: v125.5,73.88 125.45,73.92 IC2.10
  Bottom 0.813: v125.5,73.88 124.88,73.88 117,81.75 107.5,81.75 100.25,74.5 100.25,68.5 97.79,66.04 U$1.5 93.89,66.04 R47.2
SR_SHCP  (via drill 0.6)
  Top 0.813: IC2.11 124.65,72.62 v124.25,72.62
  Bottom 0.813: v124.25,72.62 124.12,72.62 116.25,80.5 108.5,80.5 101.75,73.75 101.75,67.75 97.5,63.5 U$1.6
SR_STCP  (via drill 0.6)
  Top 0.813: IC2.12 v123.51,71.39 v123.5,71.38
  Bottom 0.813: v123.5,71.38 115.62,79.25 109.5,79.25 103.25,73 103.25,66.75 97.46,60.96 U$1.7
USIM_CLK  (via drill 0.6)
  Top 0.406: v100.5,7.75 100.5,4.41 J1.C3 100.34,4.25 v99.75,4.25
  Bottom 0.406: D3.4 100.85,8.1 v100.5,7.75 | R19.2 100.4,3.6 v99.75,4.25
USIM_DATA  (via drill 0.6)
  Top 0.406: R20.2 101.75,11.5 v103,10.25
  Top 0.813: R20.2 100.6,11.65 100,12.25 100,29.13 J1.C7
  Bottom 0.406: D3.1 102.65,9.9 v103,10.25
USIM_RST  (via drill 0.6)
  Top 0.406: v103,7.75 103,4.41 J1.C2 102.88,4.25 v102.25,4.25
  Bottom 0.406: D3.3 102.65,8.1 v103,7.75 | R18.2 102.9,3.6 v102.25,4.25
USIM_VDD  (via drill 0.6)
  Top 0.406: IC1.P$30 111.75,24.5 111.25,25
  Top 0.813: v107.25,25 111.25,25 | J1.C1 105.14,4.39 v105,4.25
  Bottom 0.406: D3.5 99.25,9
  Bottom 0.813: C10.2 98.4,12.85 99.25,12 99.25,9 99.25,6.25 | C12.2 106.75,12.85 | 106.75,12.85 107.4,12.85 108.25,12 108.25,8 107.4,7.15 C13.2 105.35,6.25 105,6.25 | C11.2 98.35,7.15 99.25,6.25 | 99.25,6.25 105,6.25 | 106.75,12.85 106.25,13.35 106.25,24 v107.25,25 | v105,4.25 105,6.25
VBAT  (via drill 0.6)
  Top 0.406: U$4.3 32.13,72.5 U$4.4
  Top 0.813: U$4.3 34.53,73.11 R7.1 v34.75,73
  Top 1.676: 31.75,72.25 31.88,72.25 32.13,72.5
  Top 2.54: V_ACCU.2 17.24,77.01 18.75,75.5 18.75,70.5 20.5,68.75 28.25,68.75 31.75,72.25
  Bottom 0.406: v34.75,73 R7.1
VLOAD
  Top 0.406: U$2.4 U$2.3
  Top 2.54: F3.2A 124.16,91.34 122.25,93.25 100.5,93.25 | 100.5,93.25 76.25,93.25 | F1.2A 76.16,93.16 76.25,93.25 | F2.2A 100.16,92.91 100.5,93.25 | 76.25,93.25 53.25,93.25 51.5,91.5 51.5,86 54.5,83 54.5,78.5 | 54.5,78.5 54.5,72 47.75,65.25 33,65.25 31,63.25 31,33.84 F4.2A J2.P$1 | 54.5,78.5 54.25,78.75 J3.P$1 45.88,78.63 U$2.4
  Bottom 0.813: R12.1 100.25,88.91 F2.2A
VMDM
  Bottom 0.813: R4.1 56.15,43.1 54.62,44.62
  Bottom 1.676: MDM_SPLY.1 26.01,39.26 32.5,45.75 50.15,45.75 U$13.INP#2
  Bottom 2.54: U$11.INP#1 U$11.INP#2 52.8,25.2 49.75,28.25 49.75,37.25 U$13.INP#1 U$13.INP#2 54.62,44.62 58.05,48.05 U$7.INP#2 U$7.INP#1 52.95,58.15 U$10.INP#1 U$10.INP#2 52.95,63.45 U$6.INP#2 U$6.INP#1 66,79 66,91.25 73.5,98.75 73.5,100.48 MDM_REG_A.1
VPWR_SPLY  (1 unrouted)
  Bottom 0.813: 20.5,90.75 21.15,90.75
  Bottom 2.54: V_PWR_SPLY.2 18.26,88.51 20.5,90.75 20.5,93.58
VSCADA  (2 unrouted)
  Bottom 0.813: R16.1 121.5,101
  Bottom 2.54: SCADA_SPLY.1 9.02,70.5 14.25,70.5 16,68.75 | 16,68.75 46.25,68.75 51,73.5 51,81.5 48,84.5 48,105.5 50.75,108.25 119.5,108.25 121.5,106.25 121.5,101 121.5,100.52 SCADA_REG_A.1 124.75,100.5 J7.P$1 | 16,68.75 18.75,66 J6.P$1
VSCPC
  Bottom 0.813: 97.5,100.48 BI_REG_A.1 97.52,96.86 R10.1
  Bottom 2.54: BI_SPLY_B.1 14.48,60.52 J4.P$1 27.75,65.25 47.75,65.25 54.5,72 54.5,83 51.5,86 51.5,103.75 52.5,104.75 95.75,104.75 97.5,103 97.5,100.48 | J5.P$1 97.77,100.25 BI_REG_A.1
VSPLY  (4 unrouted)